# Altium project R01L_F.PrjPCB (part 1 of 3)
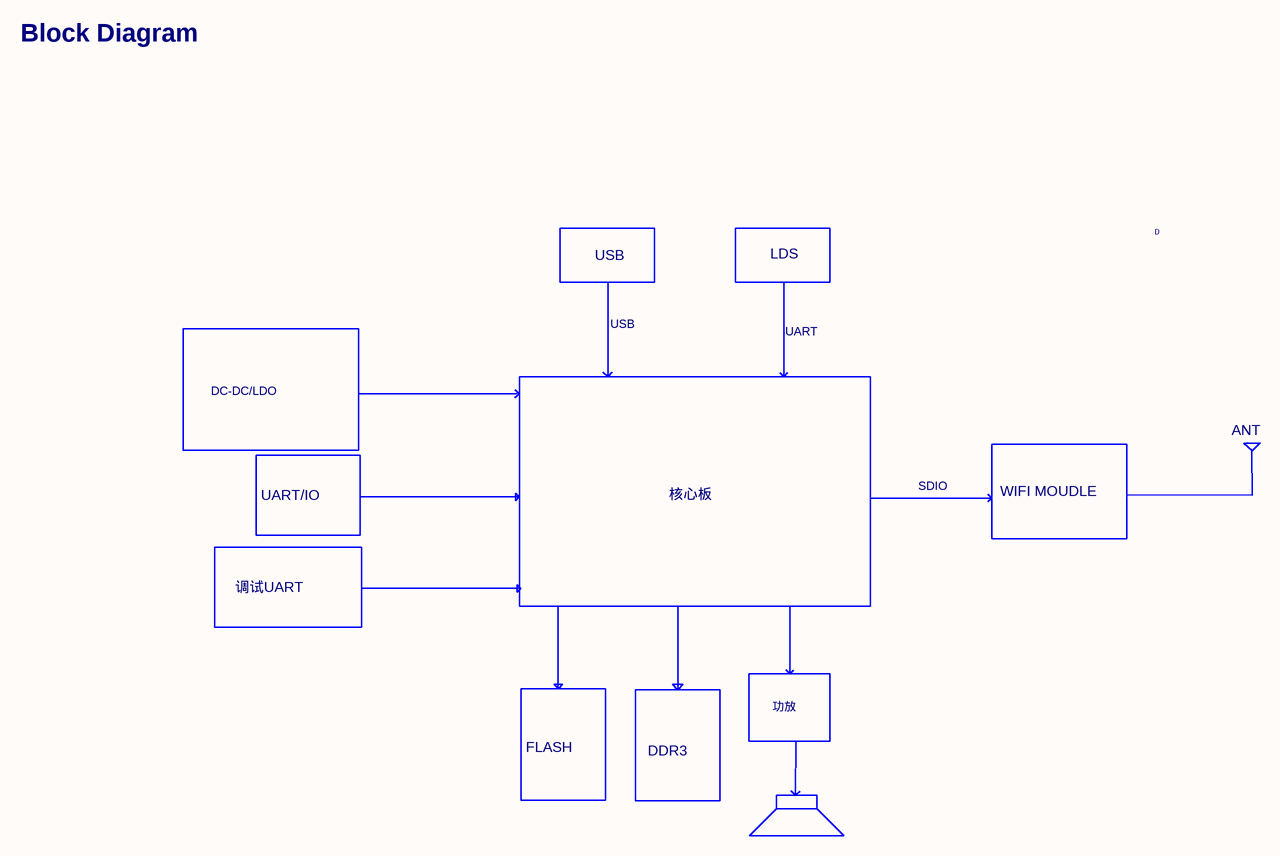
[diagram p0: 01_BLOCK_DIAGRAM.SchDoc]
kangjin: Kang jin; Organization: 阿米诺技术; Title: R01L_F
22 sheets, 404 parts. Net scope: flat (ports and power ports of the same name join across sheets).
Board file: R01_F_V10.PcbDoc
Sheets:
  01_BLOCK_DIAGRAM.SchDoc
  02_POWERDIAGRAM-WITHOUT_BATTERY.SchDoc
  03a_POWER-DISCRETE.SchDoc
  04_POWER.SchDoc
  05_OSC_PLL.SchDoc
  06_DDR_CONTROLLER.SchDoc
  07_FLASH_CONTROLLER.SchDoc
  08_USB_CONTROLLER.SchDoc
  09_SARADC_OTP.SchDoc
  10_LCDC_MAC_I2S1_JTAG.SchDoc
  11_SDIO_SDMMC.SchDoc
  12_GPIO_I2S0_PDM_SPDIF.SchDoc
  13_ACODEC.SchDoc
  14_RAM-DDR3_1X16BIT.SchDoc
  15_FLASH-NAND_FLASH.SchDoc
  18_AUDIO_PowerAmp-AnalogT.SchDoc
  25_USB_OTG.SchDoc
  52_MIPI_Panel.SchDoc
  60_WIFI_RTL8723DS.SchDoc
  80_TY_Zigbee.SchDoc
  93.SchDoc
  26_RS485.SchDoc

## Sheet 01_BLOCK_DIAGRAM.SchDoc: R01L_F
size A3; Organization: 阿米诺技术; Address4: www.amenuo.com; DocumentNumber: Kang jin; Revision: 1.0; SheetNumber: 1; SheetTotal: 23; Rule: 1.0

### Notes on the sheet
- Block Diagram
- D
- USB
- LDS
- UART
- DC-DC/LDO
- ANT
- UART/IO
- 核心板
- SDIO
- WIFI MOUDLE
- 调试UART
- 功放
- FLASH
- DDR3
- Title
- Size:
- Date:
- A3
- Engineer:
- Time:
- Revision:
- Sheet
- of
- File:

## Sheet 02_POWERDIAGRAM-WITHOUT_BATTERY.SchDoc: P30L
size A1; Author: Kang jin; Engineer: Kang jin; Organization: 六零加智能科技; Address4: www.nidone.com.cn; Revision: 1.0; SheetNumber: 2; SheetTotal: 23
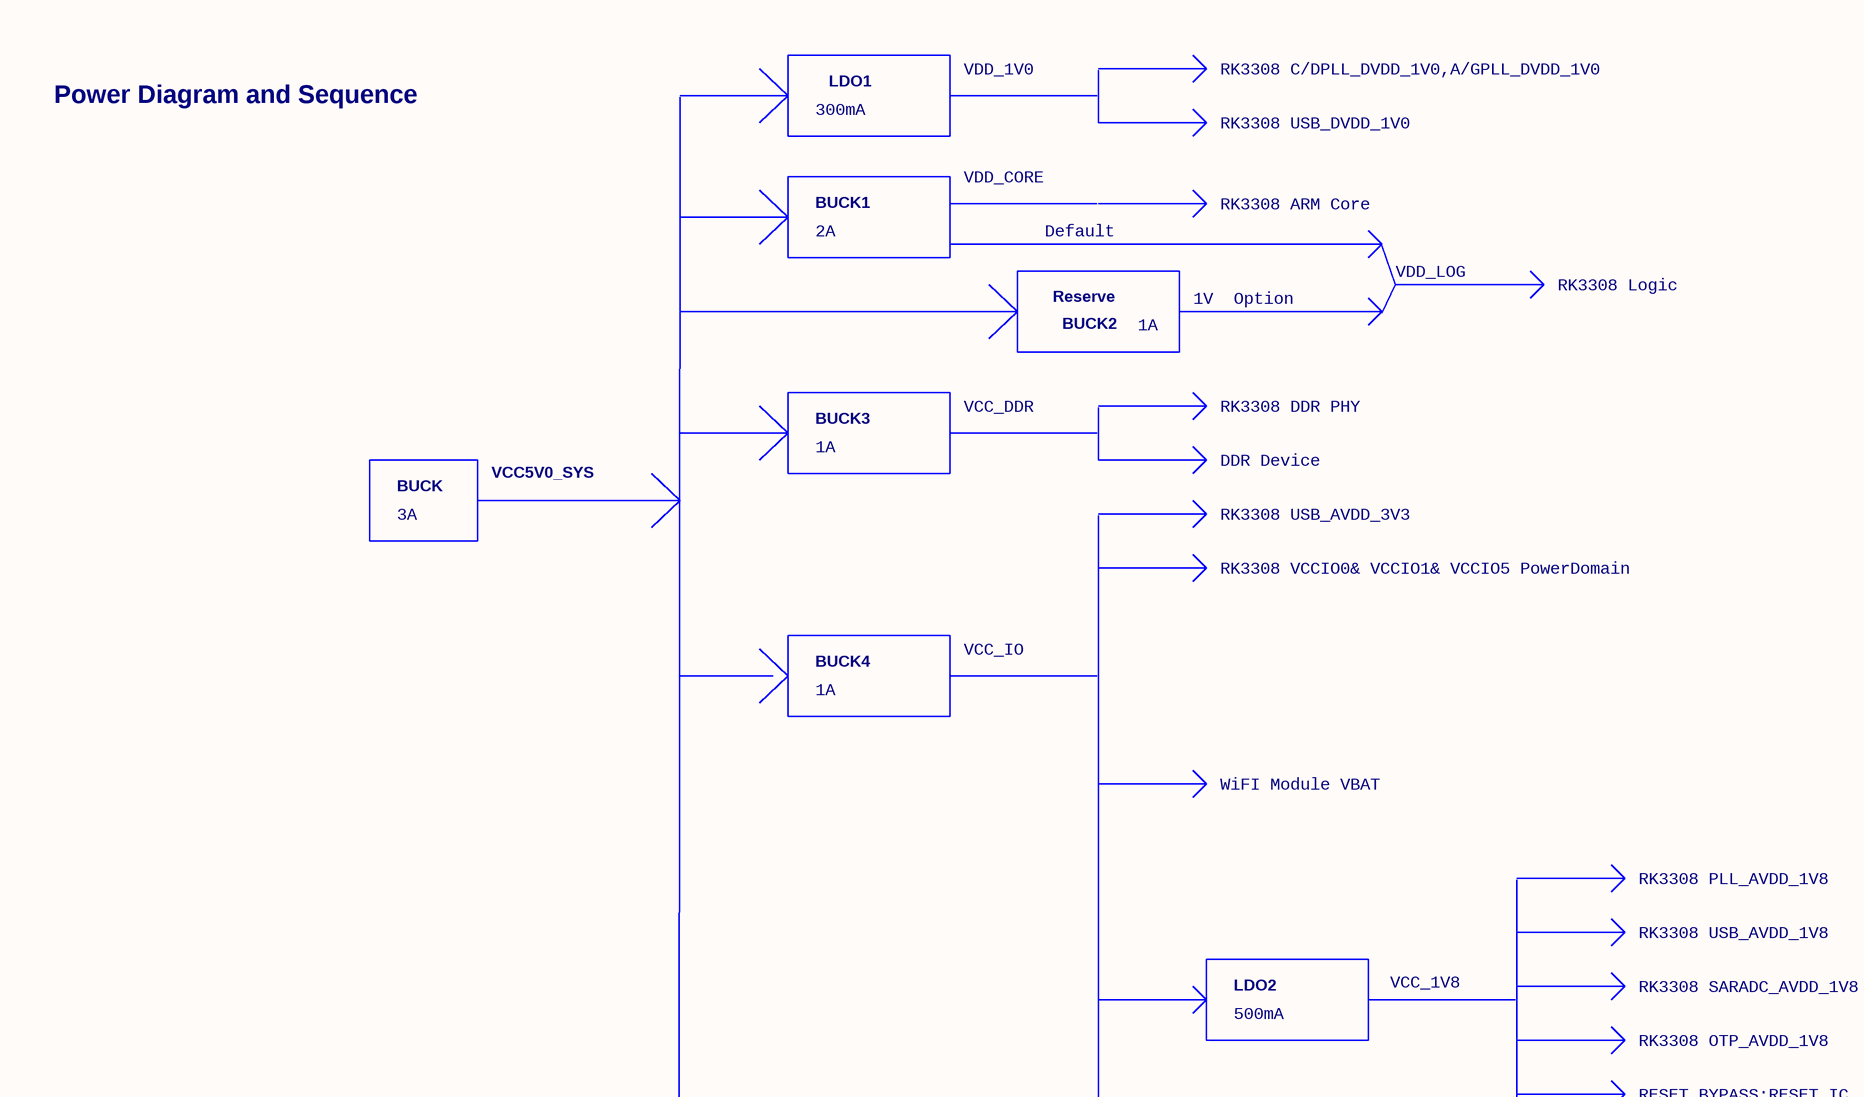
[diagram p1: 02_POWERDIAGRAM-WITHOUT_BATTERY.SchDoc, top left]
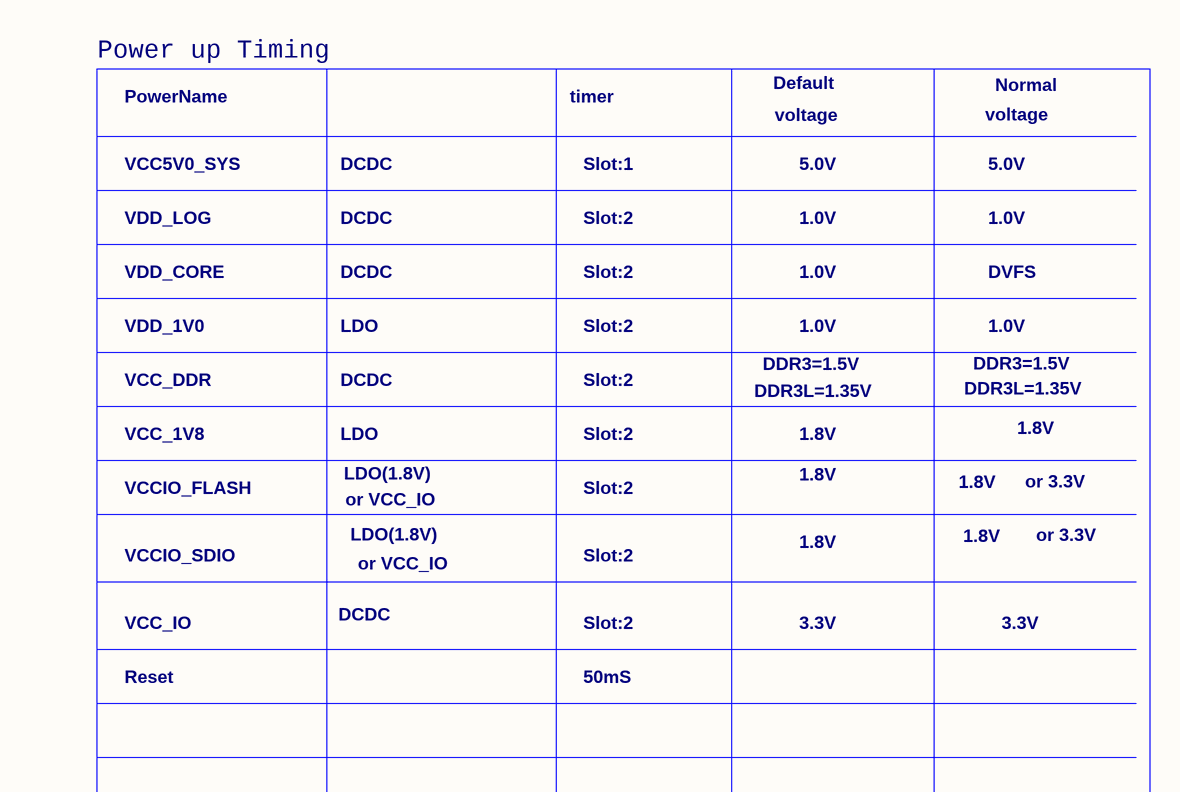
[diagram p2: 02_POWERDIAGRAM-WITHOUT_BATTERY.SchDoc, top right]
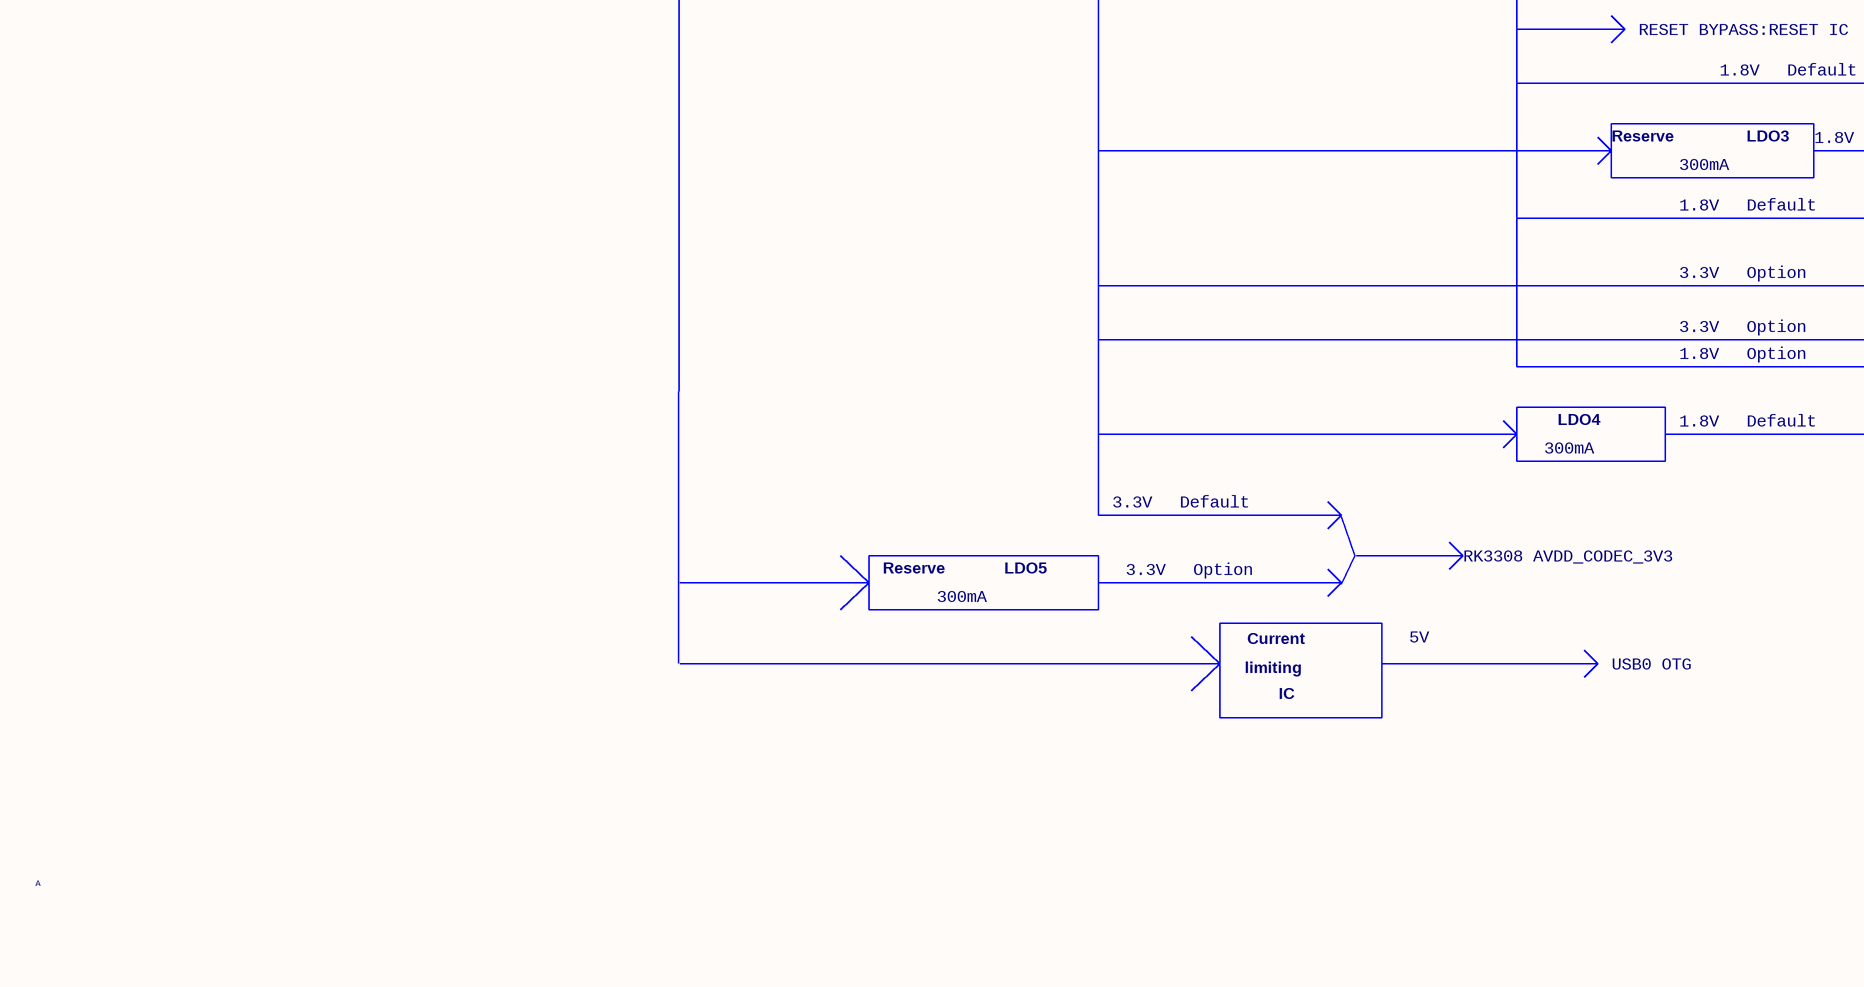
[diagram p3: 02_POWERDIAGRAM-WITHOUT_BATTERY.SchDoc, bottom left]
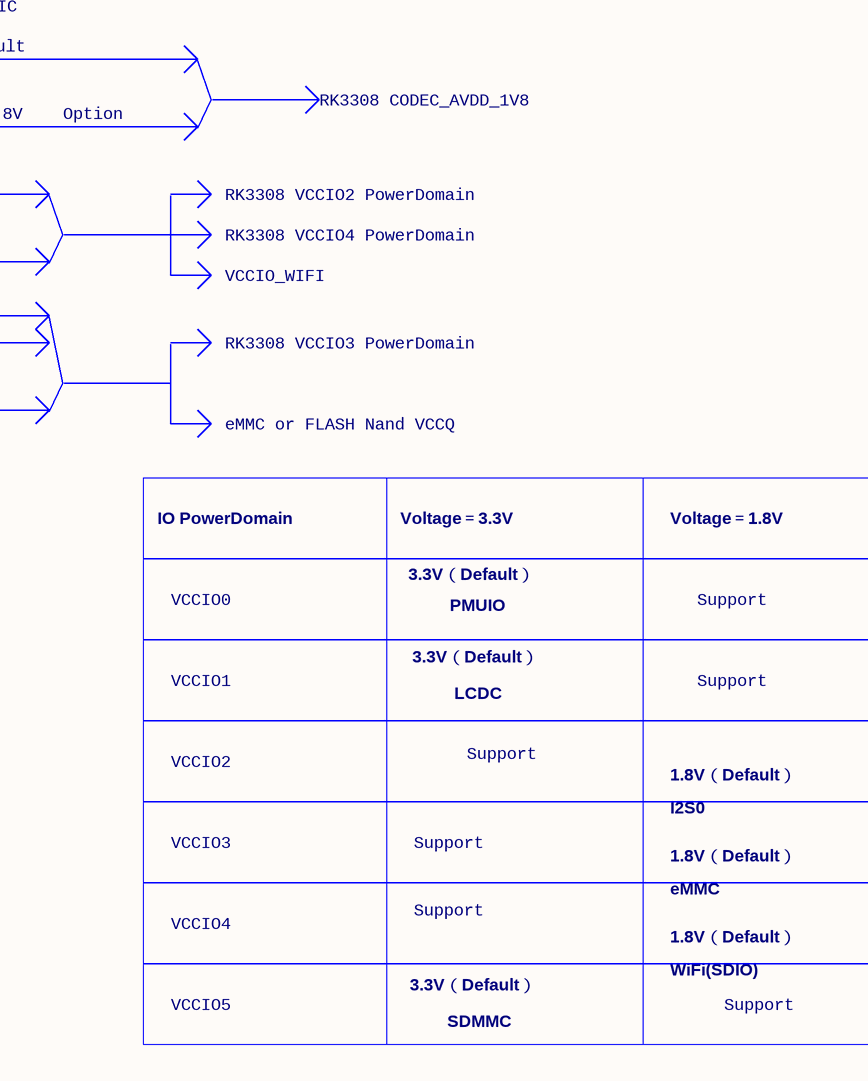
[diagram p4: 02_POWERDIAGRAM-WITHOUT_BATTERY.SchDoc, bottom right]

### Notes on the sheet
- Power Diagram and Sequence
- 300mA
- LDO1
- VDD_1V0
- RK3308 C/DPLL_DVDD_1V0,A/GPLL_DVDD_1V0
- Power up Timing
- PowerName
- timer
- Default
- voltage
- Normal
- VDD_CORE
- RK3308 USB_DVDD_1V0
- VCC5V0_SYS
- DCDC
- Slot:1
- 5.0V
- 2A
- BUCK1
- RK3308 ARM Core
- VDD_LOG
- Slot:2
- 1.0V
- Reserve
- 1V
- Option
- RK3308 Logic
- DVFS
- BUCK2
- 1A
- VCC_DDR
- LDO
- DDR3=1.5V
- DDR3L=1.35V
- BUCK3
- RK3308 DDR PHY
- VCC_1V8
- 1.8V
- 3A
- BUCK
- DDR Device
- RK3308 USB_AVDD_3V3
- VCCIO_FLASH
- LDO(1.8V)
- or VCC_IO
- or 3.3V
- RK3308 VCCIO0& VCCIO1& VCCIO5 PowerDomain
- VCCIO_SDIO
- VCC_IO
- 3.3V
- BUCK4
- Reset
- 50mS
- WiFI Module VBAT
- RK3308 PLL_AVDD_1V8
- LDO2
- RK3308 SARADC_AVDD_1V8
- RK3308 USB_AVDD_1V8
- 500mA
- RK3308 OTP_AVDD_1V8
- RESET BYPASS:RESET IC
- RK3308 CODEC_AVDD_1V8
- LDO3
- RK3308 VCCIO2 PowerDomain
- RK3308 VCCIO4 PowerDomain
- VCCIO_WIFI
- RK3308 VCCIO3 PowerDomain
- LDO4
- eMMC or FLASH Nand VCCQ
- LDO5
- RK3308 AVDD_CODEC_3V3
- IO PowerDomain
- Voltage＝3.3V
- 3.3V（Default）
- Voltage＝1.8V
- limiting
- Current
- 5V
- USB0 OTG
- VCCIO0
- PMUIO
- Support
- IC
- VCCIO1
- LCDC
- VCCIO2
- 1.8V（Default）
- A
- VCCIO3
- I2S0
- eMMC
- VCCIO4
- WiFi(SDIO)
- VCCIO5
- SDMMC
- Title:
- Size:
- Date:
- File:
- A1
- Engineer:
- Time:
- Revision:
- Sheet
- of

## Sheet 03a_POWER-DISCRETE.SchDoc: R01L_F
size A2
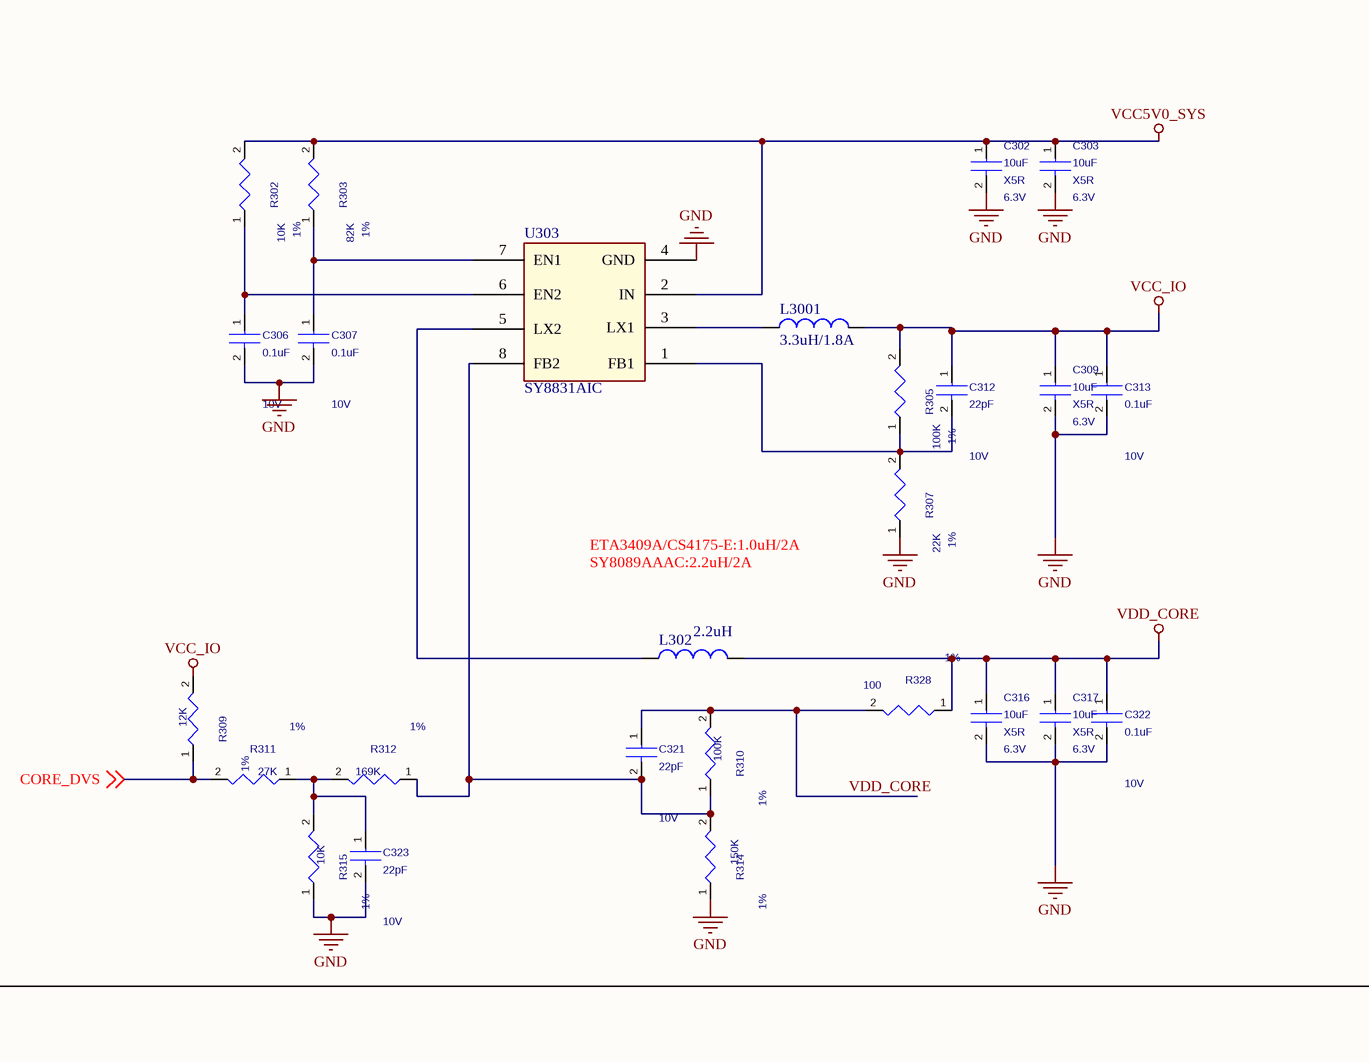
[diagram p5: 03a_POWER-DISCRETE.SchDoc, top left]
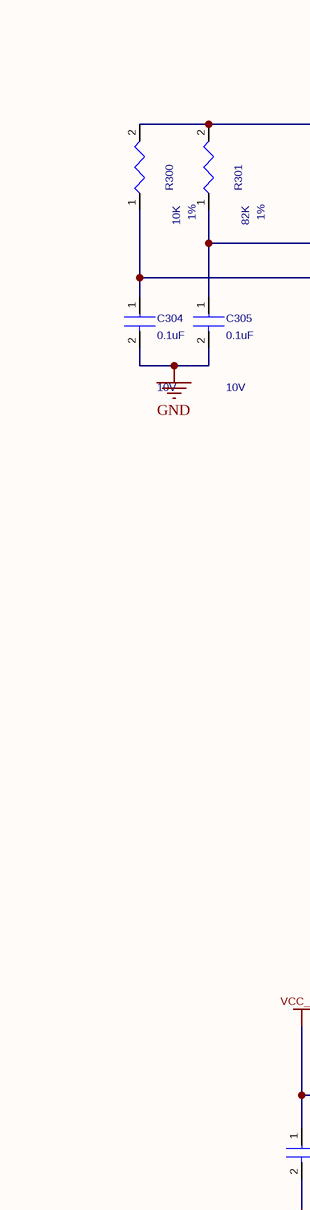
[diagram p6: 03a_POWER-DISCRETE.SchDoc, top middle]
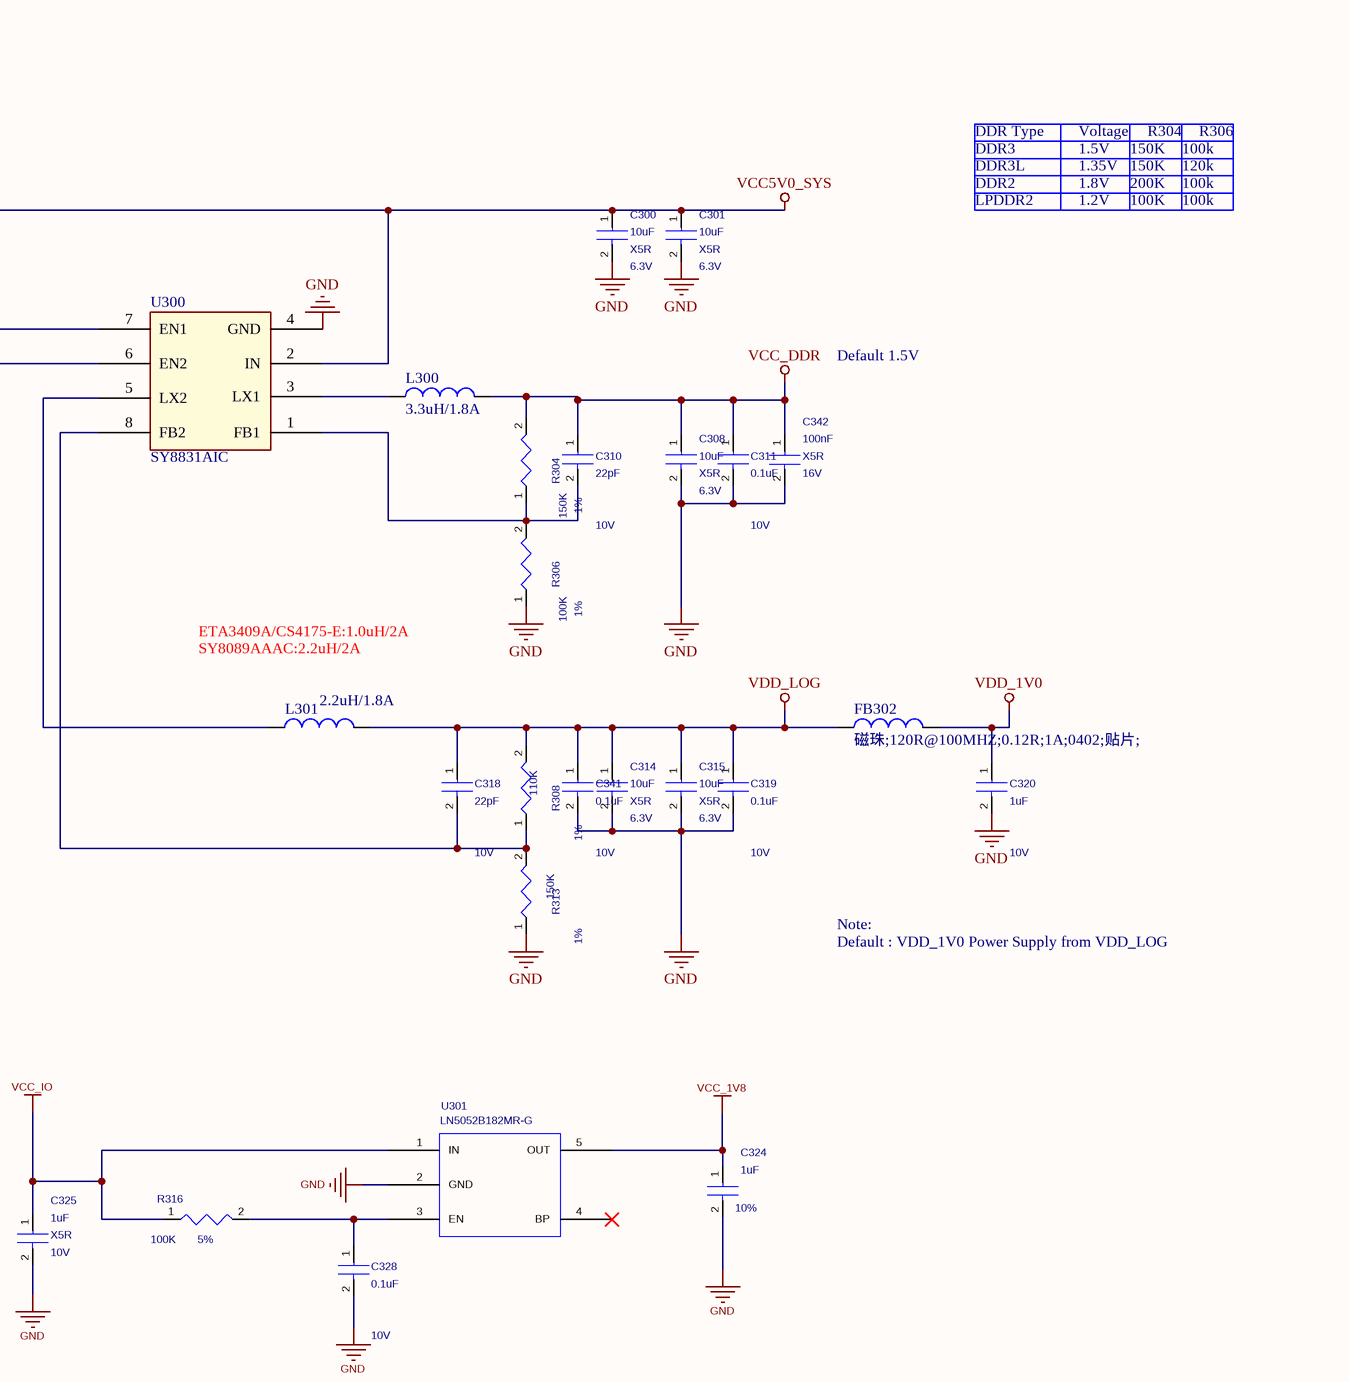
[diagram p7: 03a_POWER-DISCRETE.SchDoc, top right]
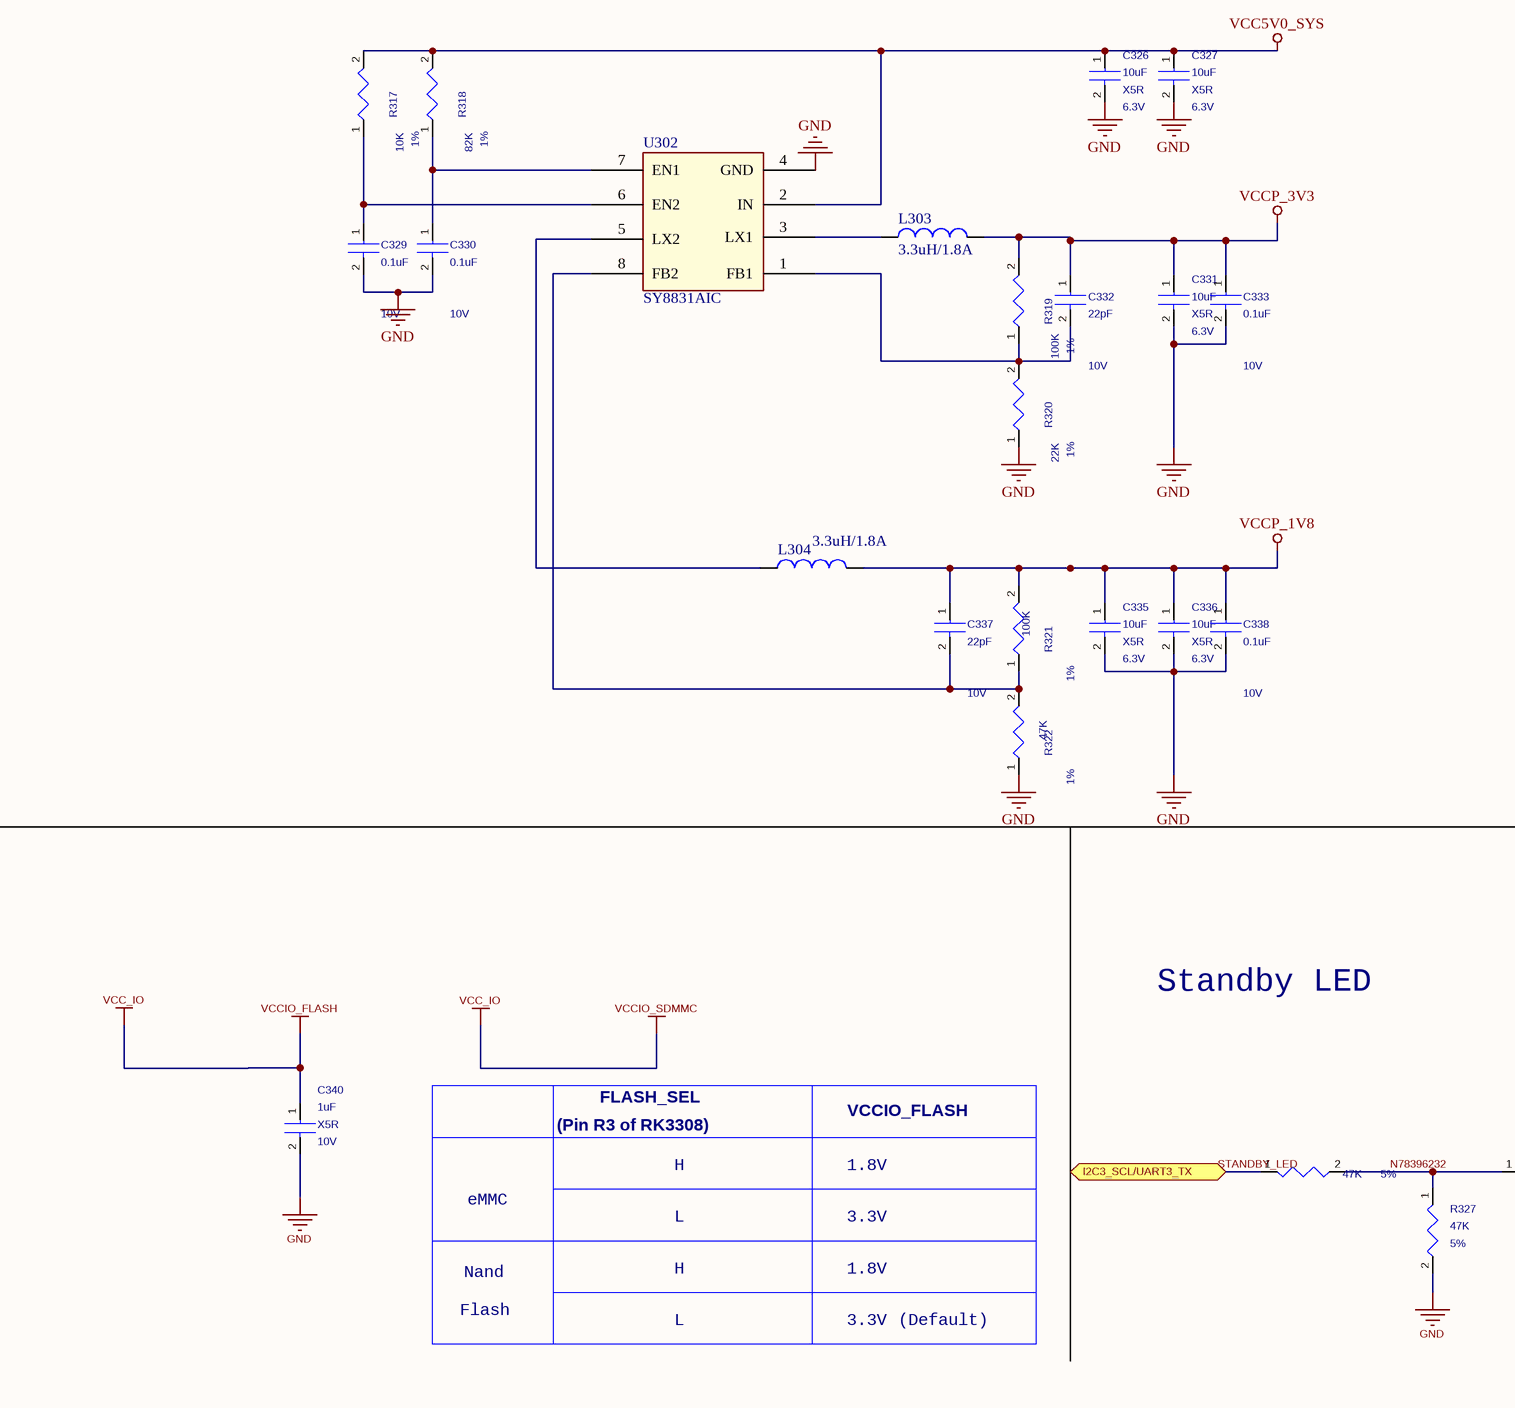
[diagram p8: 03a_POWER-DISCRETE.SchDoc, bottom left]
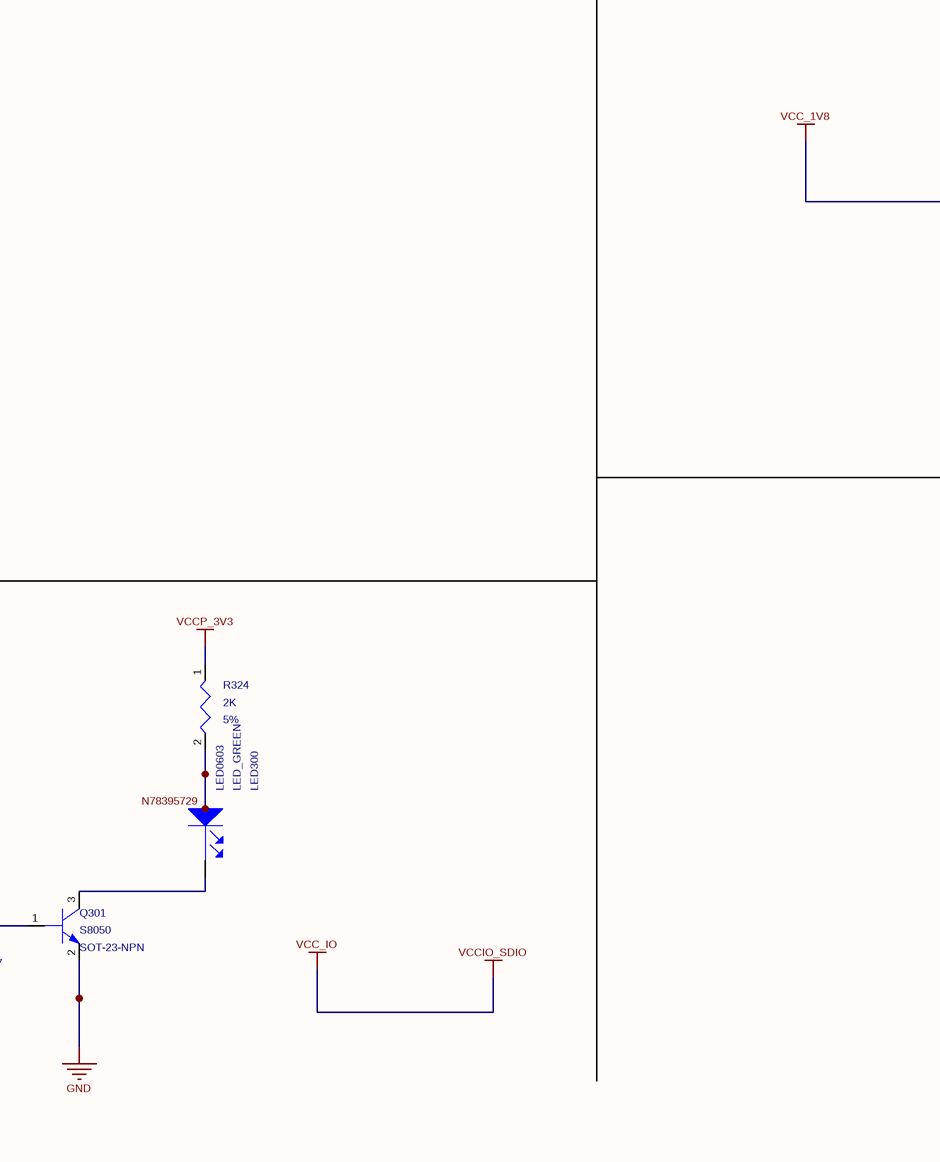
[diagram p9: 03a_POWER-DISCRETE.SchDoc, bottom middle]
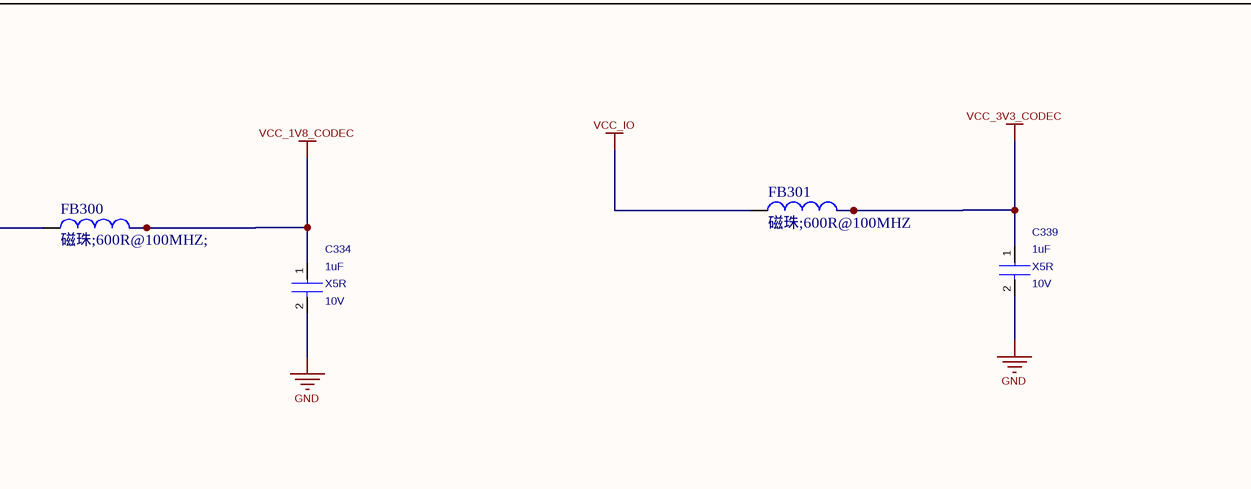
[diagram p10: 03a_POWER-DISCRETE.SchDoc, bottom right]

### Parts
C300  value 10uF  Dielectric: X5R  Voltage: 6.3V  [C0603]  (hidden comment: CAP_NP_2)
C301  value 10uF  Dielectric: X5R  Voltage: 6.3V  [C0603]  (hidden comment: CAP_NP_2)
C302  value 10uF  Dielectric: X5R  Voltage: 6.3V  [C0603]  (hidden comment: CAP_NP_2)
C303  value 10uF  Dielectric: X5R  Voltage: 6.3V  [C0603]  (hidden comment: CAP_NP_2)
C304  value 0.1uF  Voltage: 10V  [C0402]  (hidden comment: CAP_NP_2)
C305  value 0.1uF  Voltage: 10V  [C0402]  (hidden comment: CAP_NP_2)
C306  value 0.1uF  Voltage: 10V  [C0402]  (hidden comment: CAP_NP_2)
C307  value 0.1uF  Voltage: 10V  [C0402]  (hidden comment: CAP_NP_2)
C308  value 10uF  Dielectric: X5R  Voltage: 6.3V  [C0603]  (hidden comment: CAP_NP_2)
C309  value 10uF  Dielectric: X5R  Voltage: 6.3V  [C0603]  (hidden comment: CAP_NP_2)
C310  value 22pF  Voltage: 10V  [C0402]  (hidden comment: CAP_NP_2)
C311  value 0.1uF  Voltage: 10V  [C0402]  (hidden comment: CAP_NP_2)
C312  value 22pF  Voltage: 10V  [C0402]  (hidden comment: CAP_NP_2)
C313  value 0.1uF  Voltage: 10V  [C0402]  (hidden comment: CAP_NP_2)
C314  value 10uF  Dielectric: X5R  Voltage: 6.3V  [C0603]  (hidden comment: CAP_NP_2)
C315  value 10uF  Dielectric: X5R  Voltage: 6.3V  [C0603]  (hidden comment: CAP_NP_2)
C316  value 10uF  Dielectric: X5R  Voltage: 6.3V  [C0603]  (hidden comment: CAP_NP_2)
C317  value 10uF  Dielectric: X5R  Voltage: 6.3V  [C0603]  (hidden comment: CAP_NP_2)
C318  value 22pF  Voltage: 10V  [C0402]  (hidden comment: CAP_NP_2)
C319  value 0.1uF  Voltage: 10V  [C0402]  (hidden comment: CAP_NP_2)
C320  value 1uF  Voltage: 10V  [C0402]  (hidden comment: CAP_NP_2)
C321  value 22pF  Voltage: 10V  [C0402]  (hidden comment: CAP_NP_2)
C322  value 0.1uF  Voltage: 10V  [C0402]  (hidden comment: CAP_NP_2)
C323  value 22pF  Voltage: 10V  [C0402]  (hidden comment: CAP_NP_2)
C324  value 1uF  Tolerance: 10%  [C0402]  (hidden comment: CAP_NP_2)
C325  value 1uF  Voltage: 10V  Dielectric: X5R  [C0402]  (hidden comment: CAP_NP_2)
C326  value 10uF  Dielectric: X5R  Voltage: 6.3V  [C0603]  (hidden comment: CAP_NP_2)
C327  value 10uF  Dielectric: X5R  Voltage: 6.3V  [C0603]  (hidden comment: CAP_NP_2)
C328  value 0.1uF  Voltage: 10V  [C0402]  (hidden comment: CAP_NP_2)
C329  value 0.1uF  Voltage: 10V  [C0402]  (hidden comment: CAP_NP_2)
C330  value 0.1uF  Voltage: 10V  [C0402]  (hidden comment: CAP_NP_2)
C331  value 10uF  Dielectric: X5R  Voltage: 6.3V  [C0603]  (hidden comment: CAP_NP_2)
C332  value 22pF  Voltage: 10V  [C0402]  (hidden comment: CAP_NP_2)
C333  value 0.1uF  Voltage: 10V  [C0402]  (hidden comment: CAP_NP_2)
C334  value 1uF  Voltage: 10V  Dielectric: X5R  [C0402]  (hidden comment: CAP_NP_2)
C335  value 10uF  Dielectric: X5R  Voltage: 6.3V  [C0603]  (hidden comment: CAP_NP_2)
C336  value 10uF  Dielectric: X5R  Voltage: 6.3V  [C0603]  (hidden comment: CAP_NP_2)
C337  value 22pF  Voltage: 10V  [C0402]  (hidden comment: CAP_NP_2)
C338  value 0.1uF  Voltage: 10V  [C0402]  (hidden comment: CAP_NP_2)
C339  value 1uF  Voltage: 10V  Dielectric: X5R  [C0402]  (hidden comment: CAP_NP_2)
C340  value 1uF  Voltage: 10V  Dielectric: X5R  [C0402]  (hidden comment: CAP_NP_2)
C341  value 0.1uF  Voltage: 10V  [C0402]  (hidden comment: CAP_NP_2)
C342  value 100nF  Voltage: 16V  Dielectric: X5R  [C0402]  (hidden comment: CAP_NP_2)
FB300  磁珠;600R@100MHZ;  [L0402]
FB301  磁珠;600R@100MHZ  [L0402]
FB302  磁珠;120R@100MHZ;0.12R;1A;0402;贴片;  [L0402]
L300  3.3uH/1.8A  [IND2520]
L301  2.2uH/1.8A  [IND2520]
L302  2.2uH  [IND2520]
L303  3.3uH/1.8A  [IND2520]
L304  3.3uH/1.8A  [IND2520]
L3001  3.3uH/1.8A  [IND2520]
LED300  value LED_GREEN  [LED0603]  (hidden comment: LED)
Q301  value S8050  PCB DECAL: SOT-23-NPN  [SOT23]  (hidden comment: NPN)
R300  value 10K  Tolerance: 1%  [R0402]  (hidden comment: RESISTOR)
R301  value 82K  Tolerance: 1%  [R0402]  (hidden comment: RESISTOR)
R302  value 10K  Tolerance: 1%  [R0402]  (hidden comment: RESISTOR)
R303  value 82K  Tolerance: 1%  [R0402]  (hidden comment: RESISTOR)
R304  value 150K  Tolerance: 1%  [R0402]  (hidden comment: RESISTOR)
R305  value 100K  Tolerance: 1%  [R0402]  (hidden comment: RESISTOR)
R306  value 100K  Tolerance: 1%  [R0402]  (hidden comment: RESISTOR)
R307  value 22K  Tolerance: 1%  [R0402]  (hidden comment: RESISTOR)
R308  value 110K  Tolerance: 1%  [R0402]  (hidden comment: RESISTOR)
R309  value 12K  Tolerance: 1%  [R0402]  (hidden comment: RESISTOR)
R310  value 100K  Tolerance: 1%  [R0402]  (hidden comment: RESISTOR)
R311  value 27K  Tolerance: 1%  [R0402]  (hidden comment: RESISTOR)
R312  value 169K  Tolerance: 1%  [R0402]  (hidden comment: RESISTOR)
R313  value 150K  Tolerance: 1%  [R0402]  (hidden comment: RESISTOR)
R314  value 150K  Tolerance: 1%  [R0402]  (hidden comment: RESISTOR)
R315  value 10K  Tolerance: 1%  [R0402]  (hidden comment: RESISTOR)
R316  value 100K  Tolerance: 5%  [R0402]  (hidden comment: RESISTOR)
R317  value 10K  Tolerance: 1%  [R0402]  (hidden comment: RESISTOR)
R318  value 82K  Tolerance: 1%  [R0402]  (hidden comment: RESISTOR)
R319  value 100K  Tolerance: 1%  [R0402]  (hidden comment: RESISTOR)
R320  value 22K  Tolerance: 1%  [R0402]  (hidden comment: RESISTOR)
R321  value 100K  Tolerance: 1%  [R0402]  (hidden comment: RESISTOR)
R322  value 47K  Tolerance: 1%  [R0402]  (hidden comment: RESISTOR)
R324  value 2K  Tolerance: 5%  [R0402]  (hidden comment: RESISTOR)
R326  value 47K  Tolerance: 5%  [R0402]  (hidden comment: RESISTOR)
R327  value 47K  Tolerance: 5%  [R0402]  (hidden comment: RESISTOR)
R328  value 100  Tolerance: 1%  [R0402]  (hidden comment: RESISTOR)
U300  SY8831AIC  [TSOT23-8]
U301  LN5052B182MR-G  [SOT_23_5]
U302  SY8831AIC  [TSOT23-8]
U303  SY8831AIC  [TSOT23-8]

### Ports
I2C3_SCL/UART3_TX (bidir)

### Nets
GND: C300.2 C301.2 C302.2 C303.2 C304.2 C305.2 C306.2 C307.2 C308.2 C309.2 C311.2 C313.2 C314.2 C315.2 C316.2 C317.2 C319.2 C320.2 C322.2 C323.2 C324.2 C325.2 C326.2 C327.2 C328.2 C329.2 C330.2 C331.2 C333.2 C334.2 C335.2 C336.2 C338.2 C339.2 C340.2 C341.2 C342.2 Q301.2(EMITTER) R306.1 R307.1 R313.1 R314.1 R315.1 R320.1 R322.1 R327.2 U300.4(GND) U301.2(GND) U302.4(GND) U303.4(GND)
VCC5V0_SYS: C300.1 C301.1 C302.1 C303.1 C326.1 C327.1 R300.2 R301.2 R302.2 R303.2 R317.2 R318.2 U300.2(IN) U302.2(IN) U303.2(IN)
VCC_1V8: C324.1 FB300.1 U301.5(OUT)
VCC_1V8_CODEC: C334.1 FB300.2
VCC_3V3_CODEC: C339.1 FB301.2
VCC_DDR: C308.1 C310.1 C311.1 C342.1 L300.2 R304.2
VCC_IO: C309.1 C312.1 C313.1 C325.1 C340.1 FB301.1 L3001.2 R305.2 R309.2 R316.1 U301.1(IN)  [also labelled VCCIO_FLASH, VCCIO_SDIO, VCCIO_SDMMC]
VCCP_1V8: C335.1 C336.1 C337.1 C338.1 L304.2 R321.2
VCCP_3V3: C331.1 C332.1 C333.1 L303.2 R319.2 R324.1
VDD_1V0: C320.1 FB302.2
VDD_CORE: C316.1 C317.1 C321.1 C322.1 L302.2 R310.2 R328.1 R328.2
VDD_LOG: C314.1 C315.1 C318.1 C319.1 C341.1 FB302.1 L301.2 R308.2
CORE_DVS: R309.1 R311.2 ; off-sheet CORE_DVS
I2C3_SCL/UART3_TX: R326.1 ; port I2C3_SCL/UART3_TX
N78396232: Q301.1(BASE) R326.2 R327.1
NetC304_1: C304.1 R300.1 U300.6(EN2)
NetC305_1: C305.1 R301.1 U300.7(EN1)
NetC306_1: C306.1 R302.1 U303.6(EN2)
NetC307_1: C307.1 R303.1 U303.7(EN1)
NetC310_2: C310.2 R304.1 R306.2 U300.1(FB1)
NetC312_2: C312.2 R305.1 R307.2 U303.1(FB1)
NetC318_2: C318.2 R308.1 R313.2 U300.8(FB2)
NetC321_2: C321.2 R310.1 R312.1 R314.2 U303.8(FB2)
NetC323_1: C323.1 R311.1 R312.2 R315.2
NetC328_1: C328.1 R316.2 U301.3(EN)
NetC329_1: C329.1 R317.1 U302.6(EN2)
NetC330_1: C330.1 R318.1 U302.7(EN1)
NetC332_2: C332.2 R319.1 R320.2 U302.1(FB1)
NetC337_2: C337.2 R321.1 R322.2 U302.8(FB2)
NetL300_1: L300.1 U300.3(LX1)
NetL301_1: L301.1 U300.5(LX2)
NetL302_1: L302.1 U303.5(LX2)
NetL303_1: L303.1 U302.3(LX1)
NetL304_1: L304.1 U302.5(LX2)
NetL3001_1: L3001.1 U303.3(LX1)
NetLED300_1: LED300.1(ANODE) R324.2
NetLED300_2: LED300.2(CATHODE) Q301.3(COLLECTOR)

Not connected (* = marked no-connect by the designer): U301 4(BP)*

### Notes on the sheet
- DDR Type
- DDR3
- DDR3L
- DDR2
- LPDDR2
- Voltage
- 1.5V
- 1.35V
- 1.8V
- 1.2V
- 150K
- 200K
- 100K
- R304
- 100k
- 120k
- R306
- Default 1.5V
- ETA3409A/CS4175-E:1.0uH/2A
- SY8089AAAC:2.2uH/2A
- Note:
- Default : VDD_1V0 Power Supply from VDD_LOG
- Standby LED
- FLASH_SEL
- (Pin R3 of RK3308)
- H
- VCCIO_FLASH
- Nand
- eMMC
- L
- 3.3V
- Flash
- (Default)
- Labels drawn without touching a wire or pin: N78395729, STANDBY_LED
- Title
- Size:
- Date:
- File:
- A2
- Number:
- Time:
- Revision:
- Sheet
- of

### Library data of the parts
C300-C303 C308 C309 C314-C317 C326 C327 C331 C335 C336 = CAP_NP_2: cap,10.00uF,+/-10%,6.3V,X5R,C0603; Manufacturer: TDK; RK_PN: C1608X5R0J106K080AB; Priority: A; Tolerance: 10%; Created_by: JJJ; Source_Path: Z:\RK_STANDARD_LIBRARY\CADENCE_CIS\RK_DISCRETE.OLB; Number: 1; PCB DECAL: C0603; Part_Type: C0603; Manufacturer_PN: C1608X5R0J106K080AB
C304-C307 C311 C313 C319 C322 C328-C330 C333 C338 C341 = CAP_NP_2: cap,0.1uF,+/-10%,10V,X5R,C0402; Manufacturer: TDK; RK_PN: C1005X5R1A105K050BB; Priority: A; C_Voltage: 6.3V; Tolerance: 10%; Created_by: JJJ; Source_Path: Z:\RK_STANDARD_LIBRARY\CADENCE_CIS\RK_DISCRETE.OLB; Part_Type: C0402; Dielectric: X5R; Manufacturer_PN: C1005X5R1A105K050BB; PCB DECAL: C0402
C310 C312 C318 C321 C323 C332 C337 = CAP_NP_2: cap,22pF,+/-10%,10V,X5R,C0402; Manufacturer: TDK; RK_PN: C1005X5R1A105K050BB; Priority: A; C_Voltage: 6.3V; Tolerance: 10%; Created_by: JJJ; Source_Path: Z:\RK_STANDARD_LIBRARY\CADENCE_CIS\RK_DISCRETE.OLB; Part_Type: C0402; Dielectric: X5R; Manufacturer_PN: C1005X5R1A105K050BB; PCB DECAL: C0402
C320 = CAP_NP_2: cap,1uF,+/-10%,10V,X5R,C0402; Manufacturer: TDK; RK_PN: C1005X5R1A105K050BB; Priority: A; C_Voltage: 6.3V; Tolerance: 10%; Created_by: JJJ; Source_Path: Z:\RK_STANDARD_LIBRARY\CADENCE_CIS\RK_DISCRETE.OLB; Part_Type: C0402; Dielectric: X5R; Manufacturer_PN: C1005X5R1A105K050BB; PCB DECAL: C0402
C324 = CAP_NP_2: cap,1.00uF,+/-10%,10V,X5R,C0402; Manufacturer_PN: C1005X5R1A105K050BB; Manufacturer: TDK; Created_by: JJJ; C_Voltage: 6.3V; Priority: A; Source_Path: Z:\RK_STANDARD_LIBRARY\CADENCE_CIS\RK_DISCRETE.OLB; PCB DECAL: C0402; Voltage: 10V; Dielectric: X5R; Part_Type: C0402; RK_PN: C1005X5R1A105K050BB
C325 = CAP_NP_2: cap,1.00uF,+/-10%,10V,X5R,C0402; Manufacturer: TDK; RK_PN: C1005X5R1A105K050BB; Priority: A; C_Voltage: 6.3V; Tolerance: 10%; Created_by: JJJ; Source_Path: Z:\RK_STANDARD_LIBRARY\CADENCE_CIS\RK_DISCRETE.OLB; PCB DECAL: C0402; Part_Type: C0402; Manufacturer_PN: C1005X5R1A105K050BB
C334 C339 C340 = CAP_NP_2: cap,1.00uF,+/-10%,10V,X5R,C0402; Manufacturer_PN: C1005X5R1A105K050BB; Manufacturer: TDK; Created_by: JJJ; Tolerance: 10%; C_Voltage: 6.3V; Priority: A; Source_Path: Z:\RK_STANDARD_LIBRARY\CADENCE_CIS\RK_DISCRETE.OLB; PCB DECAL: C0402; Part_Type: C0402; RK_PN: C1005X5R1A105K050BB
C342 = CAP_NP_2: cap,100.00nF,+/-10%,16V,X5R,C0402; Manufacturer: TDK; Number: 1; RK_PN: C1005X5R1C104K050BA; Priority: A; Tolerance: 10%; Created_by: JJJ; Source_Path: Z:\RK_STANDARD_LIBRARY\CADENCE_CIS\RK_DISCRETE.OLB; PCB DECAL: C0402; Part_Type: C0402; Manufacturer_PN: C1005X5R1C104K050BA
FB300 = INDUCTOR: GZ0603D601TF
FB301 = INDUCTOR: L0603-0欧姆-1A
FB302 = INDUCTOR: PZ1005U121-1R0T
L300 L303 L304 L3001 = INDUCTOR: SWPA252012S3R3MT
L301 L302 = INDUCTOR: SPH252012H2R2MT
LED300 = LED: 贴片LED灯，0603，绿色; Created_by: JJJ; Priority: A; Source_Path: Z:\RK_STANDARD_LIBRARY\CADENCE_CIS\RK_DISCRETE.OLB; PCB DECAL: LED0603; Part_Type: LED; RK_PN: LED_GREEN
Q301 = NPN: S8050,SOT23; Manufacturer_PN: S8050_SOT23; Manufacturer: 长电; Created_by: JJJ; Pc: 0.3W; Vceo: 25V; Ic: 0.5A; Priority: A; Source_Path: Z:\RK_STANDARD_LIBRARY\CADENCE_CIS\RK_DISCRETE.OLB; Number: 1; Geometry.Height: 1.100mm; Part_Type: NPN; RK_PN: S8050
R300 R302 R315 R317 = RESISTOR: ?用厚膜电阻,10K,+/-1%,R0402,1/16W.; Manufacturer_PN: RC0402FR-0727KL; Manufacturer: YAGEO; Created_by: YTL; Wattage: 1/16W; Priority: A; Source_Path: Z:\RK_STANDARD_LIBRARY\CADENCE_CIS\RK_DISCRETE.OLB; PCB DECAL: R0402; Part_Type: ?用厚膜电阻; RK_PN: RC0402FR-0727KL
R301 R303 R318 = RESISTOR: ?用厚膜电阻,82K,+/-1%,R0402,1/16W.; Manufacturer_PN: RC0402FR-0727KL; Manufacturer: YAGEO; Created_by: YTL; Wattage: 1/16W; Priority: A; Source_Path: Z:\RK_STANDARD_LIBRARY\CADENCE_CIS\RK_DISCRETE.OLB; PCB DECAL: R0402; Part_Type: ?用厚膜电阻; RK_PN: RC0402FR-0727KL
R304 R313 R314 = RESISTOR: ?用厚膜电阻,150K,+/-1%,R0402,1/16W.; Manufacturer_PN: RC0402FR-0727KL; Manufacturer: YAGEO; Created_by: YTL; Wattage: 1/16W; Priority: A; Source_Path: Z:\RK_STANDARD_LIBRARY\CADENCE_CIS\RK_DISCRETE.OLB; PCB DECAL: R0402; Part_Type: ?用厚膜电阻; RK_PN: RC0402FR-0727KL
R305 R306 R310 R319 R321 = RESISTOR: ?用厚膜电阻,100K,+/-1%,R0402,1/16W.; Manufacturer_PN: RC0402FR-0727KL; Manufacturer: YAGEO; Created_by: YTL; Wattage: 1/16W; Priority: A; Source_Path: Z:\RK_STANDARD_LIBRARY\CADENCE_CIS\RK_DISCRETE.OLB; PCB DECAL: R0402; Part_Type: ?用厚膜电阻; RK_PN: RC0402FR-0727KL
R307 R320 = RESISTOR: ?用厚膜电阻,22K,+/-1%,R0402,1/16W.; Manufacturer_PN: RC0402FR-0727KL; Manufacturer: YAGEO; Created_by: YTL; Wattage: 1/16W; Priority: A; Source_Path: Z:\RK_STANDARD_LIBRARY\CADENCE_CIS\RK_DISCRETE.OLB; PCB DECAL: R0402; Part_Type: ?用厚膜电阻; RK_PN: RC0402FR-0727KL
R308 = RESISTOR: ?用厚膜电阻,110K,+/-1%,R0402,1/16W.; Manufacturer_PN: RC0402FR-0727KL; Manufacturer: YAGEO; Created_by: YTL; Wattage: 1/16W; Priority: A; Source_Path: Z:\RK_STANDARD_LIBRARY\CADENCE_CIS\RK_DISCRETE.OLB; PCB DECAL: R0402; Part_Type: ?用厚膜电阻; RK_PN: RC0402FR-0727KL
R309 = RESISTOR: ?用厚膜电阻,12K,+/-1%,R0402,1/16W.; Manufacturer_PN: RC0402FR-0727KL; Manufacturer: YAGEO; Created_by: YTL; Wattage: 1/16W; Priority: A; Source_Path: Z:\RK_STANDARD_LIBRARY\CADENCE_CIS\RK_DISCRETE.OLB; PCB DECAL: R0402; Part_Type: ?用厚膜电阻; RK_PN: RC0402FR-0727KL
R311 = RESISTOR: ?用厚膜电阻,27K,+/-1%,R0402,1/16W.; Manufacturer_PN: RC0402FR-0727KL; Manufacturer: YAGEO; Created_by: YTL; Wattage: 1/16W; Priority: A; Source_Path: Z:\RK_STANDARD_LIBRARY\CADENCE_CIS\RK_DISCRETE.OLB; PCB DECAL: R0402; Part_Type: ?用厚膜电阻; RK_PN: RC0402FR-0727KL
R312 = RESISTOR: ?用厚膜电阻,169K,+/-1%,R0402,1/16W.; Manufacturer_PN: RC0402FR-0727KL; Manufacturer: YAGEO; Created_by: YTL; Wattage: 1/16W; Priority: A; Source_Path: Z:\RK_STANDARD_LIBRARY\CADENCE_CIS\RK_DISCRETE.OLB; PCB DECAL: R0402; Part_Type: ?用厚膜电阻; RK_PN: RC0402FR-0727KL
R316 = RESISTOR: ?用厚膜电阻,100K,+/-5%,R0402,1/16W.; Manufacturer: YAGEO; RK_PN: RC0402JR-07100KL; Priority: A; Wattage: 1/16W; Created_by: YTL; Source_Path: Z:\RK_STANDARD_LIBRARY\CADENCE_CIS\RK_DISCRETE.OLB; Number: 1; PCB DECAL: R0402; Part_Type: ?用厚膜电阻; Manufacturer_PN: RC0402JR-07100KL
R322 = RESISTOR: ?用厚膜电阻,47K,+/-1%,R0402,1/16W.; Manufacturer_PN: RC0402FR-0727KL; Manufacturer: YAGEO; Created_by: YTL; Wattage: 1/16W; Priority: A; Source_Path: Z:\RK_STANDARD_LIBRARY\CADENCE_CIS\RK_DISCRETE.OLB; PCB DECAL: R0402; Part_Type: ?用厚膜电阻; RK_PN: RC0402FR-0727KL
R324 = RESISTOR: ?用厚膜电阻,2K,+/-5%,R0402,1/16W.; Manufacturer: YAGEO; RK_PN: RC0402JR-072KL; Priority: A; Wattage: 1/16W; Created_by: YTL; Source_Path: Z:\RK_STANDARD_LIBRARY\CADENCE_CIS\RK_DISCRETE.OLB; PCB DECAL: R0402; Part_Type: ?用厚膜电阻; Manufacturer_PN: RC0402JR-072KL
R326 = RESISTOR: ?用厚膜电阻,47K,+/-5%,R0402,1/16W.; Manufacturer_PN: RC0402JR-0747KL; Manufacturer: YAGEO; Created_by: YTL; Wattage: 1/16W; Priority: A; Source_Path: Z:\RK_STANDARD_LIBRARY\CADENCE_CIS\RK_DISCRETE.OLB; PCB DECAL: R0402; Part_Type: ?用厚膜电阻; RK_PN: RC0402JR-0747KL
R327 = RESISTOR: ?用厚膜电阻,47K,+/-5%,R0402,1/16W.; Manufacturer: YAGEO; RK_PN: RC0402JR-0747KL; Priority: A; Wattage: 1/16W; Created_by: YTL; Source_Path: Z:\RK_STANDARD_LIBRARY\CADENCE_CIS\RK_DISCRETE.OLB; PCB DECAL: R0402; Part_Type: ?用厚膜电阻; Manufacturer_PN: RC0402JR-0747KL
R328 = RESISTOR: ?用厚膜电阻,100,+/-1%,R0402,1/16W.; Manufacturer_PN: RC0402FR-0727KL; Manufacturer: YAGEO; Created_by: YTL; Wattage: 1/16W; Priority: A; Source_Path: Z:\RK_STANDARD_LIBRARY\CADENCE_CIS\RK_DISCRETE.OLB; PCB DECAL: R0402; Part_Type: ?用厚膜电阻; RK_PN: RC0402FR-0727KL
U300 U302 U303 = SY8831: SY8831AICSOT23-8
U301 = LDO_PT5108: High-PSRR 600mA LDO.Output1.8V.; Part_Type: LDO; Manufacturer: Powtech(华润矽威）; RK_PN: ME6212C18M5G; Priority: A; Created_by: JJJ; Source_Path: Z:\RK_STANDARD_LIBRARY\CADENCE_CIS\RK_IC.OLB; Number: 1; PCB DECAL: SOT_23_5; Manufacturer_PN: LN5052B182MR-G; Value: LN5052B182MR-G

## Sheet 04_POWER.SchDoc: R01L_F
size A3; Organization: 六零加智能科技; Address4: www.nidone.com.cn; DocumentNumber: kan jin; Revision: 1.0; SheetNumber: 4; SheetTotal: 23
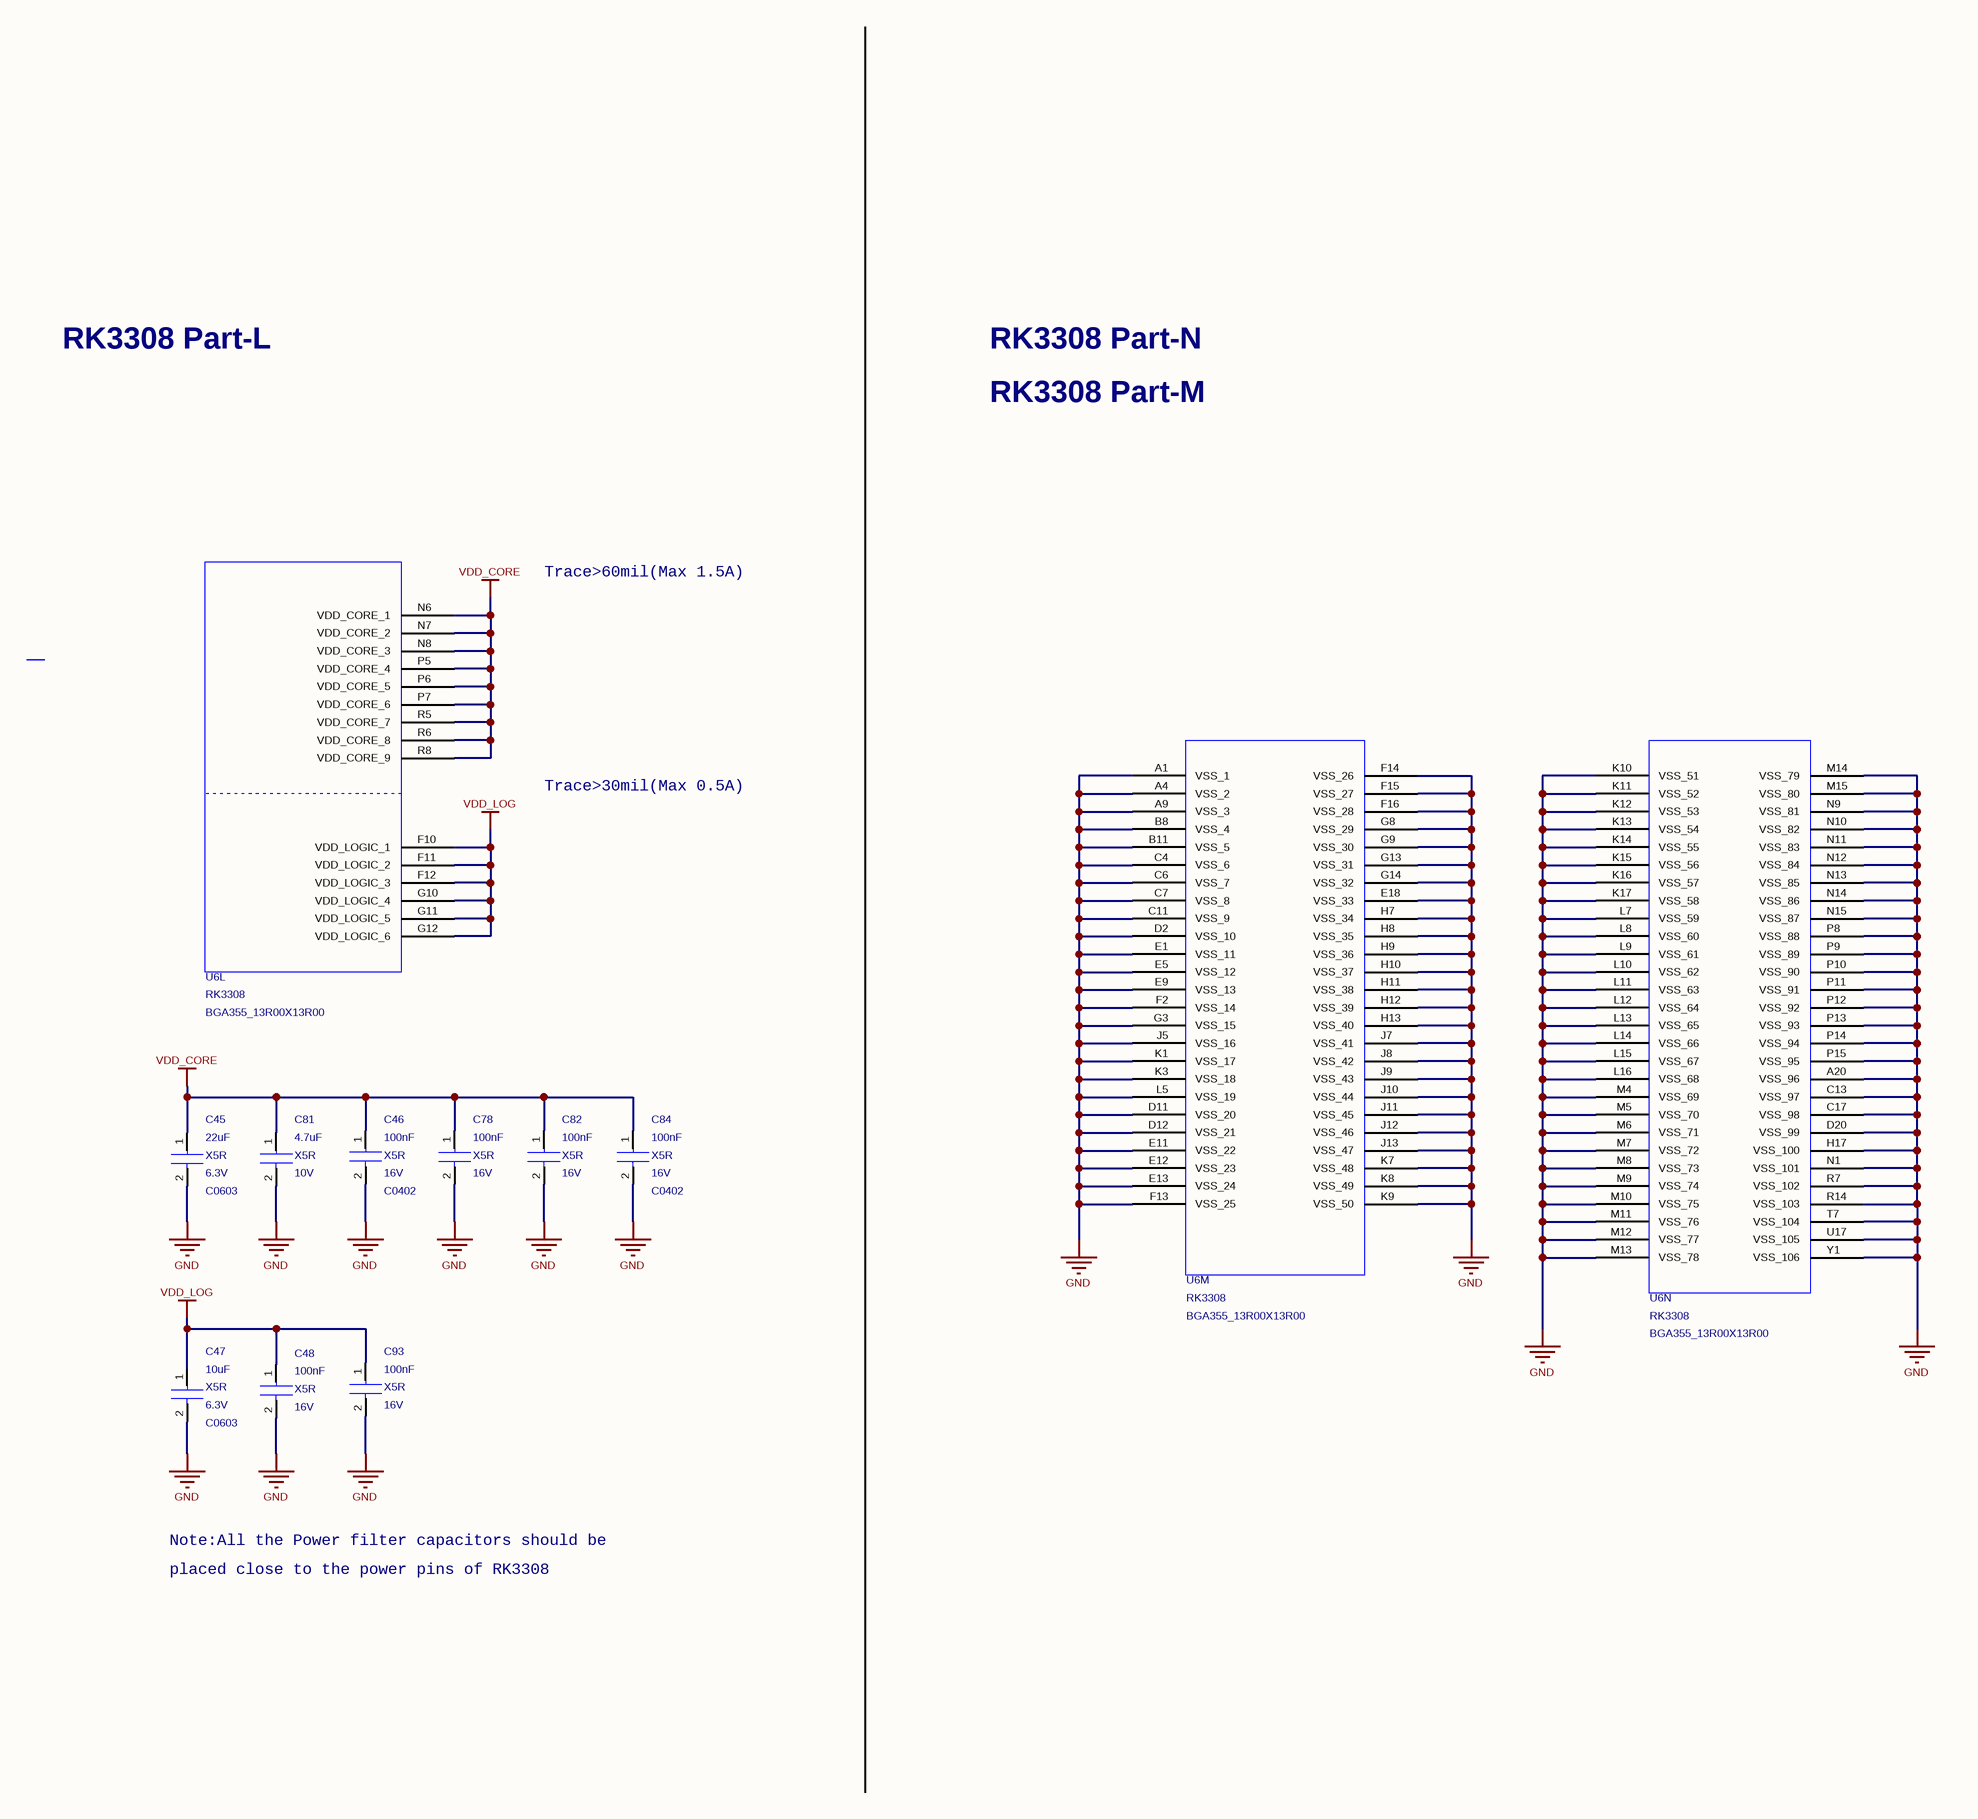
[diagram p11: 04_POWER.SchDoc]

### Parts
C45  value 22uF  Voltage: 6.3V  Dielectric: X5R  [C0603]  (hidden comment: CAP_NP_2)
C46  value 100nF  Voltage: 16V  Dielectric: X5R  [C0402]  (hidden comment: CAP_NP_2)
C47  value 10uF  Voltage: 6.3V  Dielectric: X5R  [C0603]  (hidden comment: CAP_NP_2)
C48  value 100nF  Dielectric: X5R  Voltage: 16V  [C0402]  (hidden comment: CAP_NP_2)
C78  value 100nF  Dielectric: X5R  Voltage: 16V  [C0402]  (hidden comment: CAP_NP_2)
C81  value 4.7uF  Dielectric: X5R  Voltage: 10V  [C0402]  (hidden comment: CAP_NP_2)
C82  value 100nF  Voltage: 16V  Dielectric: X5R  [C0402]  (hidden comment: CAP_NP_2)
C84  value 100nF  Dielectric: X5R  Voltage: 16V  [C0402]  (hidden comment: CAP_NP_2)
C93  value 100nF  Dielectric: X5R  Voltage: 16V  [C0402]  (hidden comment: CAP_NP_2)
U6  RK3308  [BGA355_13R00X13R00]  (parts L,M,N of 14)

### Nets
GND: C45.2 C46.2 C47.2 C48.2 C78.2 C81.2 C82.2 C84.2 C93.2 U6.A1(VSS_1) U6.A4(VSS_2) U6.A9(VSS_3) U6.A20(VSS_96) U6.B8(VSS_4) U6.B11(VSS_5) U6.C4(VSS_6) U6.C6(VSS_7) U6.C7(VSS_8) U6.C11(VSS_9) U6.C13(VSS_97) U6.C17(VSS_98) U6.D2(VSS_10) U6.D11(VSS_20) U6.D12(VSS_21) U6.D20(VSS_99) U6.E1(VSS_11) U6.E5(VSS_12) U6.E9(VSS_13) U6.E11(VSS_22) U6.E12(VSS_23) U6.E13(VSS_24) U6.E18(VSS_33) U6.F2(VSS_14) U6.F13(VSS_25) U6.F14(VSS_26) U6.F15(VSS_27) U6.F16(VSS_28) U6.G3(VSS_15) U6.G8(VSS_29) U6.G9(VSS_30) U6.G13(VSS_31) U6.G14(VSS_32) U6.H7(VSS_34) U6.H8(VSS_35) U6.H9(VSS_36) U6.H10(VSS_37) U6.H11(VSS_38) U6.H12(VSS_39) U6.H13(VSS_40) U6.H17(VSS_100) U6.J5(VSS_16) U6.J7(VSS_41) U6.J8(VSS_42) U6.J9(VSS_43) U6.J10(VSS_44) U6.J11(VSS_45) U6.J12(VSS_46) U6.J13(VSS_47) U6.K1(VSS_17) U6.K3(VSS_18) U6.K7(VSS_48) U6.K8(VSS_49) U6.K9(VSS_50) U6.K10(VSS_51) U6.K11(VSS_52) U6.K12(VSS_53) U6.K13(VSS_54) U6.K14(VSS_55) U6.K15(VSS_56) U6.K16(VSS_57) U6.K17(VSS_58) U6.L5(VSS_19) U6.L7(VSS_59) U6.L8(VSS_60) U6.L9(VSS_61) U6.L10(VSS_62) U6.L11(VSS_63) U6.L12(VSS_64) U6.L13(VSS_65) U6.L14(VSS_66) U6.L15(VSS_67) U6.L16(VSS_68) U6.M4(VSS_69) U6.M5(VSS_70) U6.M6(VSS_71) U6.M7(VSS_72) U6.M8(VSS_73) U6.M9(VSS_74) U6.M10(VSS_75) U6.M11(VSS_76) U6.M12(VSS_77) U6.M13(VSS_78) U6.M14(VSS_79) U6.M15(VSS_80) U6.N1(VSS_101) U6.N9(VSS_81) U6.N10(VSS_82) U6.N11(VSS_83) U6.N12(VSS_84) U6.N13(VSS_85) U6.N14(VSS_86) U6.N15(VSS_87) U6.P8(VSS_88) U6.P9(VSS_89) U6.P10(VSS_90) U6.P11(VSS_91) U6.P12(VSS_92) U6.P13(VSS_93) U6.P14(VSS_94) U6.P15(VSS_95) U6.R7(VSS_102) U6.R14(VSS_103) U6.T7(VSS_104) U6.U17(VSS_105) U6.Y1(VSS_106)
VDD_CORE: C45.1 C46.1 C78.1 C81.1 C82.1 C84.1 U6.N6(VDD_CORE_1) U6.N7(VDD_CORE_2) U6.N8(VDD_CORE_3) U6.P5(VDD_CORE_4) U6.P6(VDD_CORE_5) U6.P7(VDD_CORE_6) U6.R5(VDD_CORE_7) U6.R6(VDD_CORE_8) U6.R8(VDD_CORE_9)
VDD_LOG: C47.1 C48.1 C93.1 U6.F10(VDD_LOGIC_1) U6.F11(VDD_LOGIC_2) U6.F12(VDD_LOGIC_3) U6.G10(VDD_LOGIC_4) U6.G11(VDD_LOGIC_5) U6.G12(VDD_LOGIC_6)

### Notes on the sheet
- RK3308 Part-L
- RK3308 Part-N
- RK3308 Part-M
- Trace>60mil(Max 1.5A)
- Trace>30mil(Max 0.5A)
- Note:All the Power filter capacitors should be
- placed close to the power pins of RK3308
- Title
- Size:
- Date:
- A3
- Engineer:
- Time:
- Revision:
- Sheet
- of
- File:

### Library data of the parts
C45 = CAP_NP_2: cap,22.00uF,+/-20%,6.3V,X5R,C0603; Manufacturer_PN: C1608X5R0J226M080AC; Manufacturer: TDK; Created_by: JJJ; Tolerance: 20%; Priority: A; Source_Path: Z:\RK_STANDARD_LIBRARY\CADENCE_CIS\RK_DISCRETE.OLB; number: 1; PCB DECAL: C0603; Part_Type: C0603; RK_PN: C1608X5R0J226M080AC
C46 C82 = CAP_NP_2: cap,100.00nF,+/-10%,16V,X5R,C0402; Manufacturer_PN: C1005X5R1C104K050BA; Manufacturer: TDK; Created_by: JJJ; Tolerance: 10%; Priority: A; Source_Path: Z:\RK_STANDARD_LIBRARY\CADENCE_CIS\RK_DISCRETE.OLB; Number: 1; PCB DECAL: C0402; Part_Type: C0402; RK_PN: C1005X5R1C104K050BA
C47 = CAP_NP_2: cap,10.00uF,+/-10%,6.3V,X5R,C0603; Manufacturer_PN: C1608X5R0J106K080AB; Manufacturer: TDK; Created_by: JJJ; Tolerance: 10%; Priority: A; Source_Path: Z:\RK_STANDARD_LIBRARY\CADENCE_CIS\RK_DISCRETE.OLB; Number: 1; PCB DECAL: C0603; Part_Type: C0603; RK_PN: C1608X5R0J106K080AB; C_Voltage: 6.3V
C48 C78 C84 C93 = CAP_NP_2: cap,100.00nF,+/-10%,16V,X5R,C0402; Manufacturer: TDK; RK_PN: C1005X5R1C104K050BA; Priority: A; Tolerance: 10%; Created_by: JJJ; Source_Path: Z:\RK_STANDARD_LIBRARY\CADENCE_CIS\RK_DISCRETE.OLB; Number: 1; PCB DECAL: C0402; Part_Type: C0402; Manufacturer_PN: C1005X5R1C104K050BA
C81 = CAP_NP_2: cap,4.70uF,+/-10%,10V,X5R,C0402; Manufacturer: TDK; RK_PN: C1005X5R1A475K050BC; Priority: A; Tolerance: 10%; Created_by: JJJ; Source_Path: Z:\RK_STANDARD_LIBRARY\CADENCE_CIS\RK_DISCRETE.OLB; Number: 1; Part_Type: C0402; Manufacturer_PN: C1005X5R1A475K050BC; PCB DECAL: C0402
U6 = RK3308: Manufacturer: ROCKCHIP; Source_Path: E:\SCHEMETIC\RKSCH.OLB; Number: 1; PCB DECAL: BGA355_13R00X13R00; Value: RK3308; Manufacturer_PN: RK3308

## Sheet 05_OSC_PLL.SchDoc: R01L_F
size A3; Organization: 六零加智能科技; Address4: www.nidone.com.cn; DocumentNumber: kang jin; Revision: 1.0; SheetNumber: 5; SheetTotal: 23
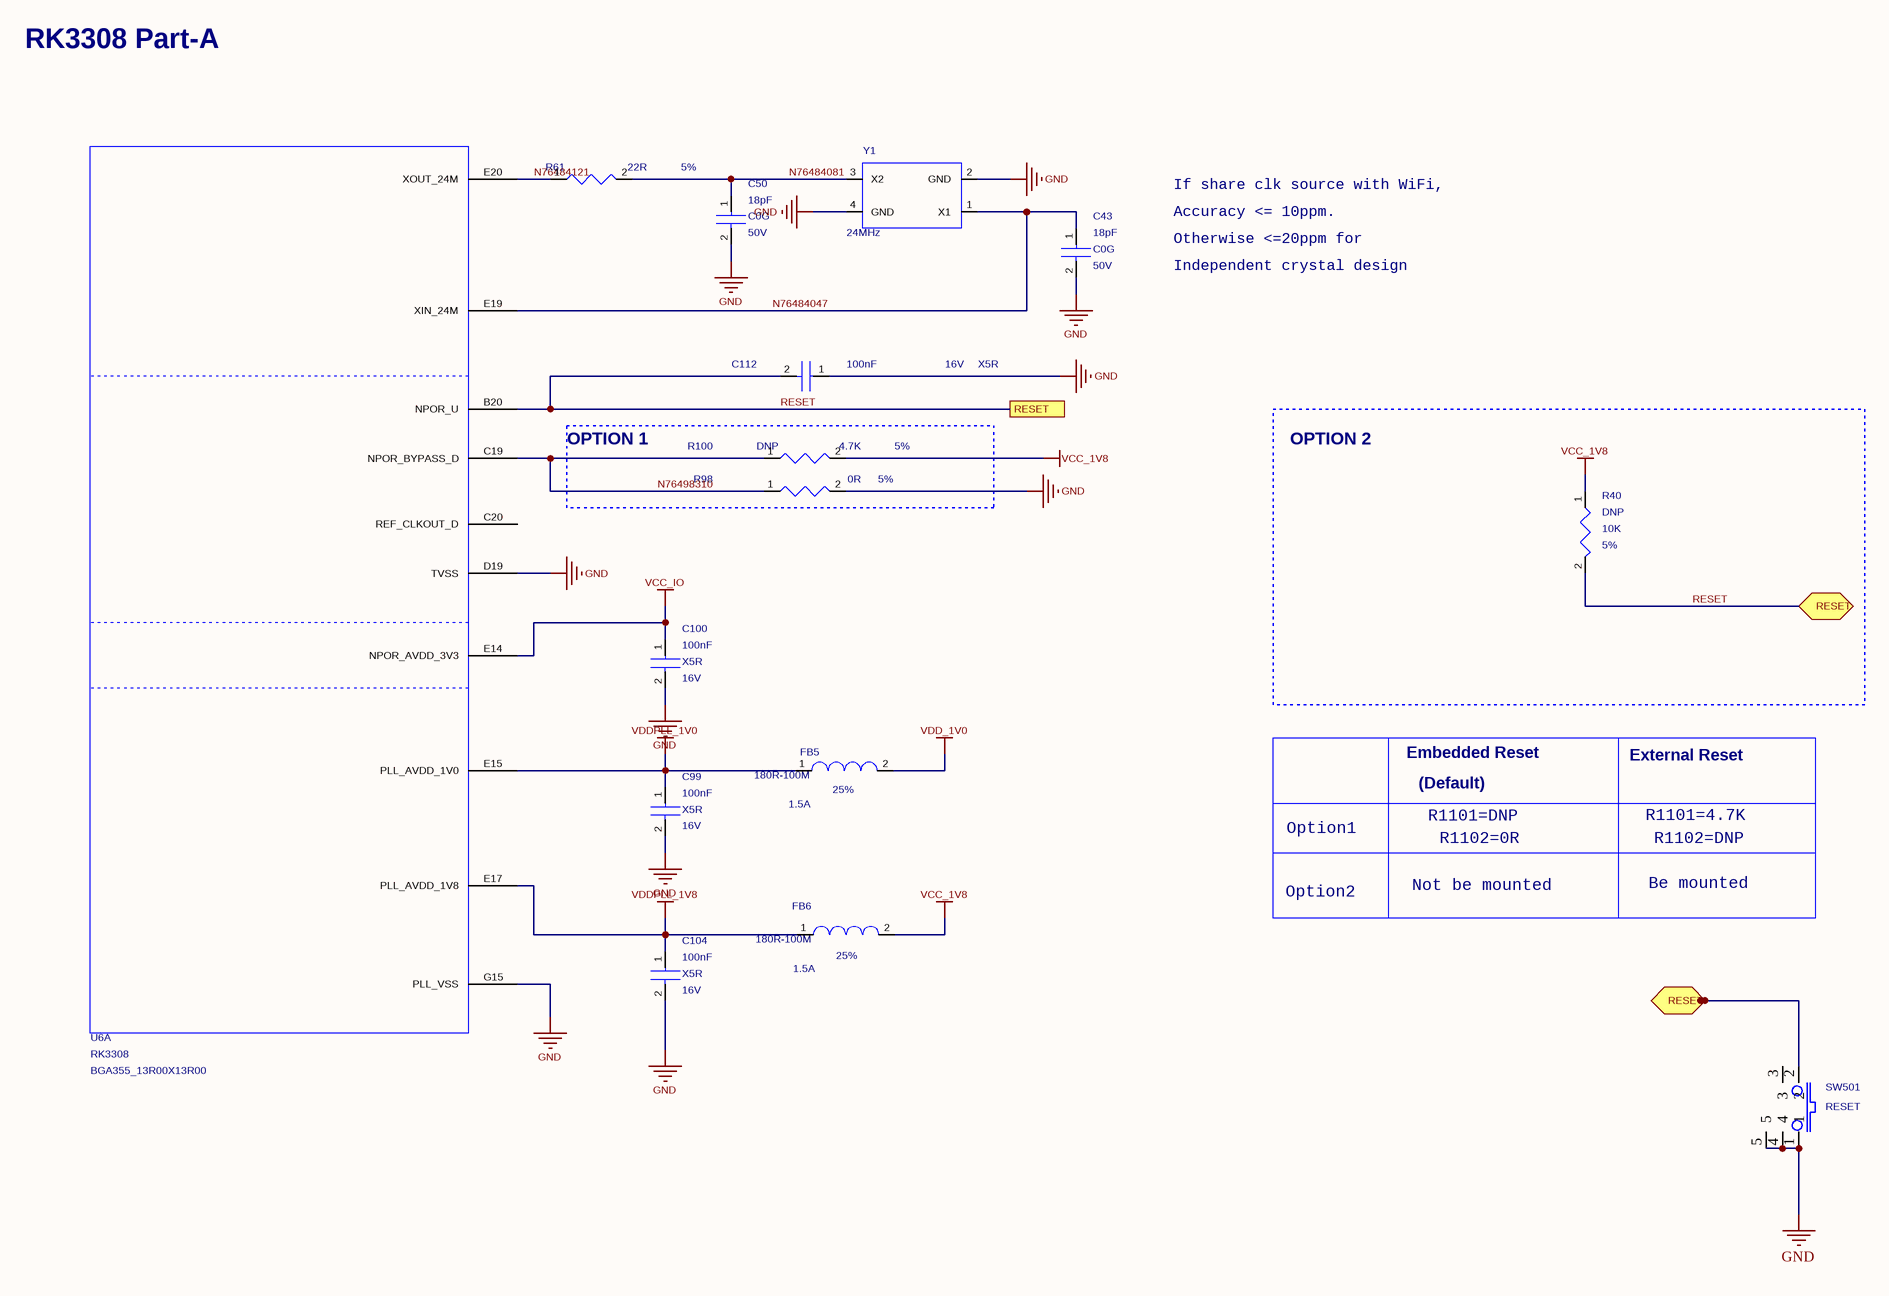
[diagram p12: 05_OSC_PLL.SchDoc]

### Parts
C43  value 18pF  Dielectric: C0G  Voltage: 50V  [C0402]  (hidden comment: CAP_NP_2)
C50  value 18pF  Dielectric: C0G  Voltage: 50V  [C0402]  (hidden comment: CAP_NP_2)
C99  value 100nF  Voltage: 16V  Dielectric: X5R  [C0402]  (hidden comment: CAP_NP_2)
C100  value 100nF  Voltage: 16V  Dielectric: X5R  [C0402]  (hidden comment: CAP_NP_2)
C104  value 100nF  Voltage: 16V  Dielectric: X5R  [C0402]  (hidden comment: CAP_NP_2)
C112  value 100nF  Dielectric: X5R  Voltage: 16V  [C0402]  (hidden comment: CAP_NP_2)
FB5  value 180R-100M  Tolerance: 25%  Irms: 1.5A  [L0603]  (hidden comment: BEAD)
FB6  value 180R-100M  Tolerance: 25%  Irms: 1.5A  [L0603]  (hidden comment: BEAD)
R40  value 10K  OPTION: DNP  Tolerance: 5%  [R0402]  (hidden comment: RESISTOR)
R61  value 22R  Tolerance: 5%  [R0402]  (hidden comment: RESISTOR)
R98  value 0R  Tolerance: 5%  [R0402]  (hidden comment: RESISTOR)
R100  value 4.7K  Tolerance: 5%  OPTION: DNP  [R0402]  (hidden comment: RESISTOR)
SW501  RESET  [SW-TS]
U6  RK3308  [BGA355_13R00X13R00]  (part A of 14)
Y1  value 24MHz  [CRY4_3R20X2R50X0R80]  (hidden comment: CRYSTAL_4P)

### Blocks framed on the sheet
OPTION 2: R40
OPTION 1: R98 R100

### Ports
RESET, RESET (bidir)

### Nets
GND: C43.2 C50.2 C99.2 C100.2 C104.2 C112.1 R98.2 SW501.1 SW501.4 SW501.5 U6.D19(TVSS) U6.G15(PLL_VSS) Y1.2(GND) Y1.4(GND)
VCC_1V8: FB6.2 R40.1 R100.2
VCC_IO: C100.1 U6.E14(NPOR_AVDD_3V3)
VDD_1V0: FB5.2
VDDPLL_1V0: C99.1 FB5.1 U6.E15(PLL_AVDD_1V0)
VDDPLL_1V8: C104.1 FB6.1 U6.E17(PLL_AVDD_1V8)
N76484047: C43.1 U6.E19(XIN_24M) Y1.1(X1)
N76484081: C50.1 R61.2 Y1.3(X2)
N76484121: R61.1 U6.E20(XOUT_24M)
N76498310: R98.1 R100.1 U6.C19(NPOR_BYPASS_D)
RESET: C112.2 R40.2 SW501.2 U6.B20(NPOR_U) ; port RESET

Not connected (* = marked no-connect by the designer): SW501 3; U6 C20(REF_CLKOUT_D)

### Notes on the sheet
- RK3308 Part-A
- If share clk source with WiFi,
- Accuracy <= 10ppm.
- Otherwise <=20ppm for
- Independent crystal design
- Embedded Reset
- External Reset
- Option1
- (Default)
- R1101=DNP
- R1102=0R
- R1101=4.7K
- R1102=DNP
- Option2
- Not be mounted
- Be mounted
- Title
- Size:
- Date:
- A3
- Engineer:
- Time:
- Revision:
- Sheet
- of
- File:

### Library data of the parts
C43 C50 = CAP_NP_2: cap,18.00pF,+/-5%,50V,C0G,C0402; Manufacturer: TDK; RK_PN: C1005C0G1H180J050BA; Priority: A; Tolerance: 5%; Created_by: JJJ; Source_Path: Z:\RK_STANDARD_LIBRARY\CADENCE_CIS\RK_DISCRETE.OLB; PCB DECAL: C0402; Part_Type: C0402; C_Voltage: 50V; Manufacturer_PN: C1005C0G1H180J050BA
C99 C100 C104 = CAP_NP_2: as C46 on sheet 04_POWER; PCB DECAL: C0402; Part_Type: C0402; RK_PN: C1005X5R1C104K050BA
C112 = CAP_NP_2: as C48 on sheet 04_POWER; PCB DECAL: C0402; Part_Type: C0402; Manufacturer_PN: C1005X5R1C104K050BA
FB5 FB6 = BEAD: Ferrite Bead,180R-100M,0.25,L0603; Manufacturer: Murata; RK_PN: BLM18PG181SN1; Priority: A; DC_Resistor: 0.09ohm; Created_by: YTL; Source_Path: Z:\RK_STANDARD_LIBRARY\CADENCE_CIS\RK_DISCRETE.OLB; PCB DECAL: L0603; Part_Type: BEAD; Manufacturer_PN: BLM18PG181SN1
R40 = RESISTOR: ?用厚膜电阻,10K,+/-5%,R0402,1/16W.; Manufacturer_PN: RC0402JR-0710KL; Manufacturer: YAGEO; Created_by: YTL; Wattage: 1/16W; Priority: A; Source_Path: Z:\RK_STANDARD_LIBRARY\CADENCE_CIS\RK_DISCRETE.OLB; PCB DECAL: R0402; Part_Type: ?用厚膜电阻; RK_PN: RC0402JR-0710KL
R61 = RESISTOR: ?用厚膜电阻,22R,+/-5%,R0402,1/16W.; Manufacturer_PN: RC0402JR-0722RL; Manufacturer: YAGEO; Created_by: YTL; Wattage: 1/16W; Priority: A; Source_Path: Z:\RK_STANDARD_LIBRARY\CADENCE_CIS\RK_DISCRETE.OLB; number: 1; PCB DECAL: R0402; Part_Type: ?用厚膜电阻; RK_PN: RC0402JR-0722RL
R98 = RESISTOR: ?用厚膜电阻,0R,+/-5%,R0402,1/16W.; Manufacturer_PN: RC0402JR-070RL; Manufacturer: YAGEO; Created_by: YTL; Wattage: 1/16W; Priority: A; Source_Path: Z:\RK_STANDARD_LIBRARY\CADENCE_CIS\RK_DISCRETE.OLB; Number: 1; PCB DECAL: R0402; Part_Type: ?用厚膜电阻; RK_PN: RC0402JR-070RL
R100 = RESISTOR: ?用厚膜电阻,4K7,+/-5%,R0402,1/16W.; Manufacturer_PN: RC0402JR-074K7L; Manufacturer: YAGEO; Created_by: YTL; Wattage: 1/16W; Priority: A; Source_Path: Z:\RK_STANDARD_LIBRARY\CADENCE_CIS\RK_DISCRETE.OLB; PCB DECAL: R0402; Part_Type: ?用厚膜电阻; RK_PN: RC0402JR-074K7L
SW501 = KEY_5PIN: TS-1086EV-AR03526; pin to pad: 1>2 2>1; Manufacturer: 褀华电子; RK PN: TS-1125S; Priority: A; Part Type: KEY; Manufacturer Part Number: TS-1125S; Created by: YWQ
U6 = RK3308: as U6 on sheet 04_POWER; PCB DECAL: BGA355_13R00X13R00; Value: RK3308; Manufacturer_PN: RK3308
Y1 = CRYSTAL_4P: 无源晶振，24M，3225,±10ppm，12pF，Hosonic; Manufacturer: Hosonic(鸿星电子); RK_PN: E3SB24.0000F12E11; Priority: A; Created_by: JJJ; Source_Path: Z:\RK_STANDARD_LIBRARY\CADENCE_CIS\RK_DISCRETE.OLB; Number: 1; PCB DECAL: CRY4_3R20X2R50X0R80; Part_Type: CRYSTAL; Manufacturer_PN: E3SB24.0000F12E11

## Sheet 06_DDR_CONTROLLER.SchDoc: R01L_F
size A3; Organization: 六零加智能科技有限公司; Address4: www.nidone.com.cn; DocumentNumber: kang jin; Revision: 1.0; SheetNumber: 6; SheetTotal: 23
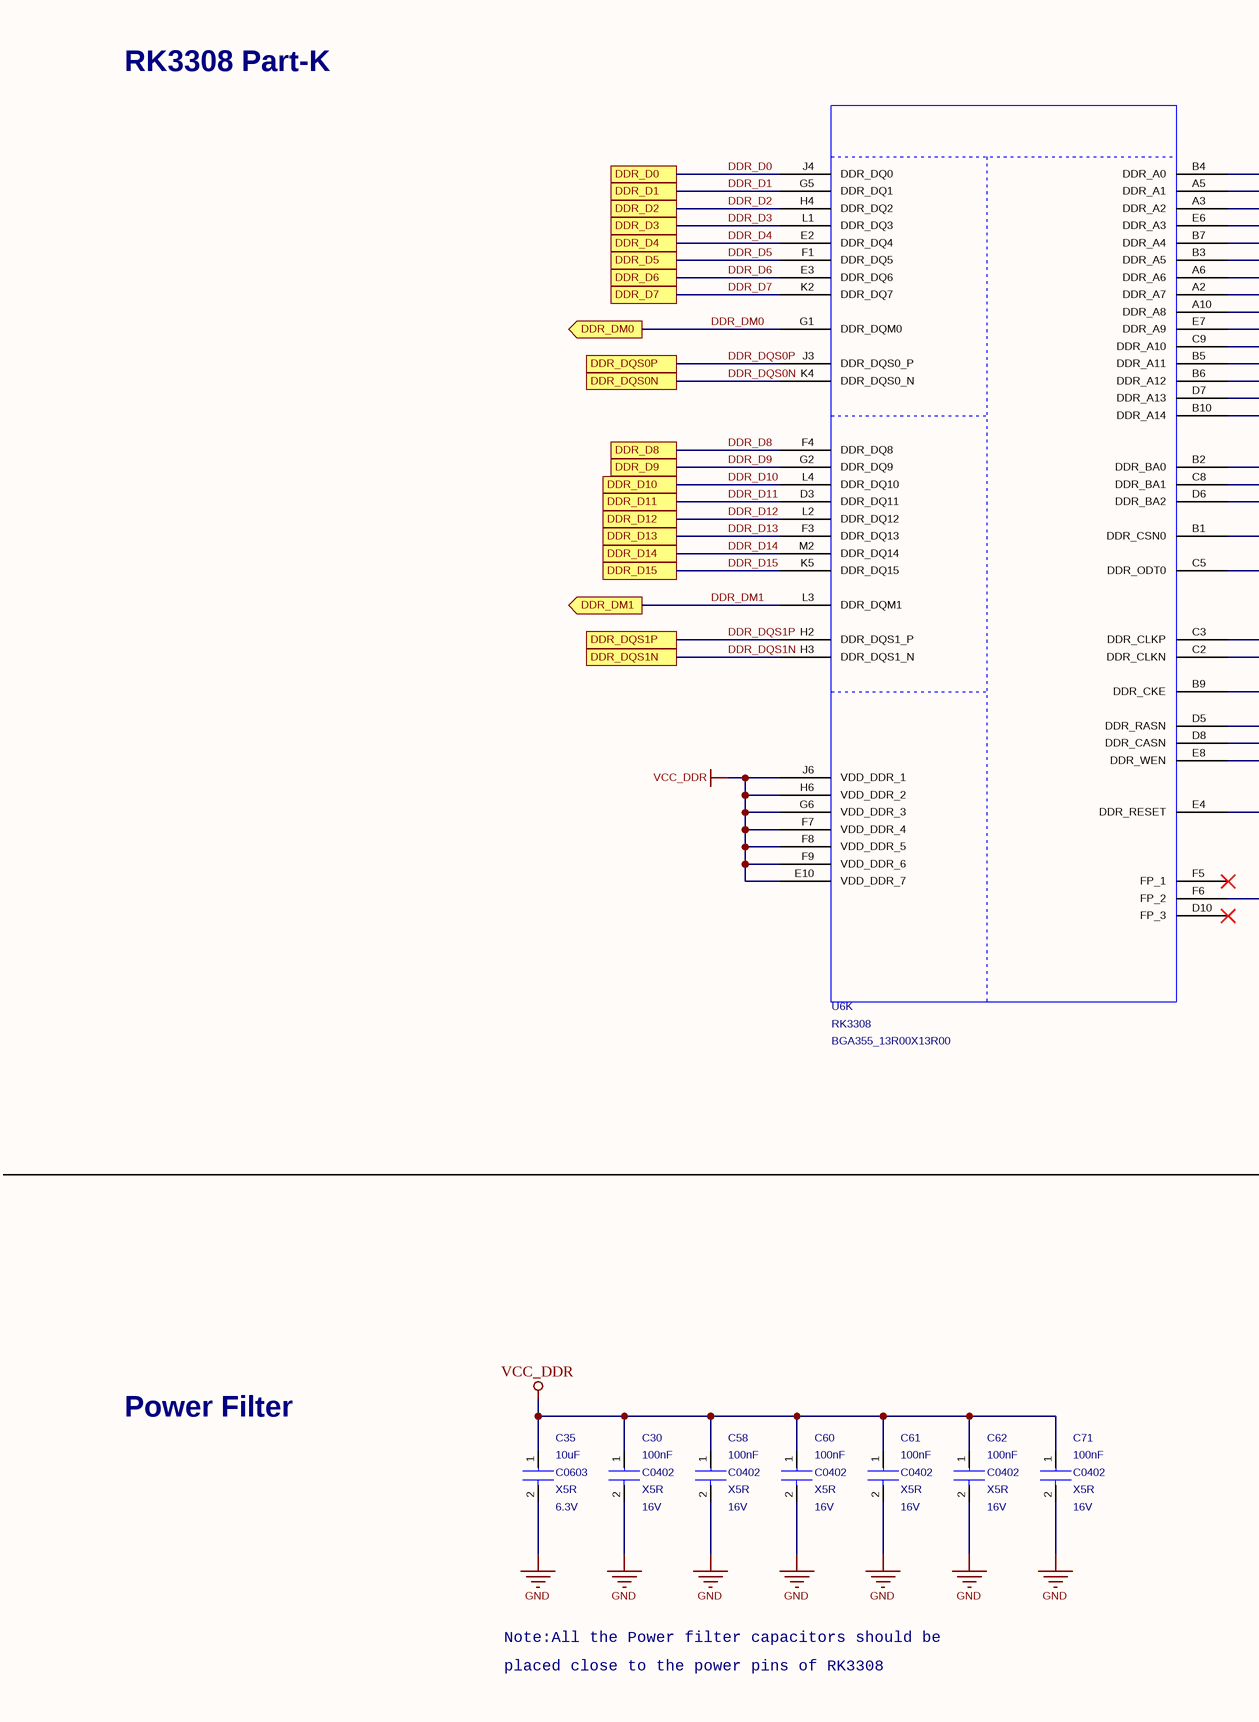
[diagram p13: 06_DDR_CONTROLLER.SchDoc, left]
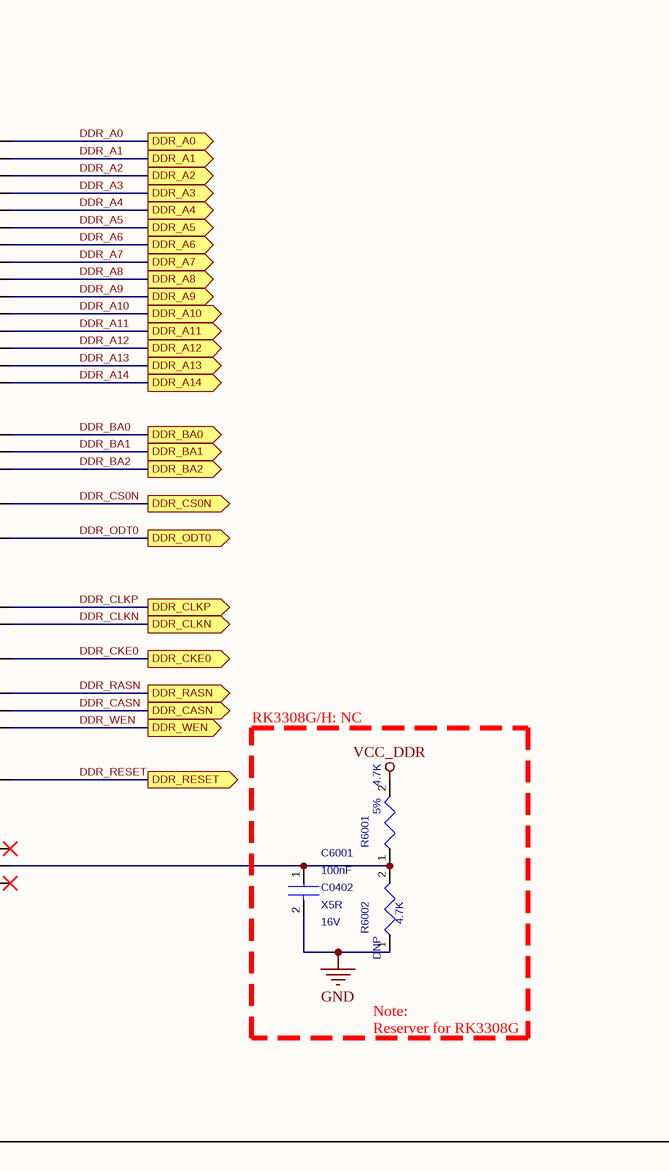
[diagram p14: 06_DDR_CONTROLLER.SchDoc, right]

### Parts
C30  value 100nF  Voltage: 16V  Dielectric: X5R  [C0402]  (hidden comment: CAP_NP_2)
C35  value 10uF  Dielectric: X5R  Voltage: 6.3V  [C0603]  (hidden comment: CAP_NP_2)
C58  value 100nF  Dielectric: X5R  Voltage: 16V  [C0402]  (hidden comment: CAP_NP_2)
C60  value 100nF  Voltage: 16V  Dielectric: X5R  [C0402]  (hidden comment: CAP_NP_2)
C61  value 100nF  Voltage: 16V  Dielectric: X5R  [C0402]  (hidden comment: CAP_NP_2)
C62  value 100nF  Voltage: 16V  Dielectric: X5R  [C0402]  (hidden comment: CAP_NP_2)
C71  value 100nF  Voltage: 16V  Dielectric: X5R  [C0402]  (hidden comment: CAP_NP_2)
C6001  value 100nF  Voltage: 16V  Dielectric: X5R  [C0402]  (hidden comment: CAP_NP_2)
R6001  value 4.7K  [R0402]  (hidden comment: RESISTOR)
R6002  value 4.7K  Tolerance: 5%  OPTION: DNP  [R0402]  (hidden comment: RESISTOR)
U6  RK3308  [BGA355_13R00X13R00]  (part K of 14)

### Ports
DDR_A0 (out), DDR_A1 (out), DDR_A2 (out), DDR_A3 (out), DDR_A4 (out), DDR_A5 (out), DDR_A6 (out), DDR_A7 (out), DDR_A8 (out), DDR_A9 (out), DDR_A10 (out), DDR_A11 (out), DDR_A12 (out), DDR_A13 (out), DDR_A14 (out), DDR_BA0 (out), DDR_BA1 (out), DDR_BA2 (out), DDR_CASN (out), DDR_CKE0 (out), DDR_CLKN (out), DDR_CLKP (out), DDR_CS0N (out), DDR_D0, DDR_D1, DDR_D2, DDR_D3, DDR_D4, DDR_D5, DDR_D6, DDR_D7, DDR_D8, DDR_D9, DDR_D10, DDR_D11, DDR_D12, DDR_D13, DDR_D14, DDR_D15, DDR_DM0 (out), DDR_DM1 (out), DDR_DQS0N, DDR_DQS0P, DDR_DQS1N, DDR_DQS1P, DDR_ODT0 (out), DDR_RASN (out), DDR_RESET (out), DDR_WEN (out)

### Nets
GND: C30.2 C35.2 C58.2 C60.2 C61.2 C62.2 C71.2 C6001.2 R6002.1
VCC_DDR: C30.1 C35.1 C58.1 C60.1 C61.1 C62.1 C71.1 R6001.2 U6.E10(VDD_DDR_7) U6.F7(VDD_DDR_4) U6.F8(VDD_DDR_5) U6.F9(VDD_DDR_6) U6.G6(VDD_DDR_3) U6.H6(VDD_DDR_2) U6.J6(VDD_DDR_1)
DDR_A0: U6.B4(DDR_A0) ; port DDR_A0
DDR_A1: U6.A5(DDR_A1) ; port DDR_A1
DDR_A2: U6.A3(DDR_A2) ; port DDR_A2
DDR_A3: U6.E6(DDR_A3) ; port DDR_A3
DDR_A4: U6.B7(DDR_A4) ; port DDR_A4
DDR_A5: U6.B3(DDR_A5) ; port DDR_A5
DDR_A6: U6.A6(DDR_A6) ; port DDR_A6
DDR_A7: U6.A2(DDR_A7) ; port DDR_A7
DDR_A8: U6.A10(DDR_A8) ; port DDR_A8
DDR_A9: U6.E7(DDR_A9) ; port DDR_A9
DDR_A10: U6.C9(DDR_A10) ; port DDR_A10
DDR_A11: U6.B5(DDR_A11) ; port DDR_A11
DDR_A12: U6.B6(DDR_A12) ; port DDR_A12
DDR_A13: U6.D7(DDR_A13) ; port DDR_A13
DDR_A14: U6.B10(DDR_A14) ; port DDR_A14
DDR_BA0: U6.B2(DDR_BA0) ; port DDR_BA0
DDR_BA1: U6.C8(DDR_BA1) ; port DDR_BA1
DDR_BA2: U6.D6(DDR_BA2) ; port DDR_BA2
DDR_CASN: U6.D8(DDR_CASN) ; port DDR_CASN
DDR_CKE0: U6.B9(DDR_CKE) ; port DDR_CKE0
DDR_CLKN: U6.C2(DDR_CLKN) ; port DDR_CLKN
DDR_CLKP: U6.C3(DDR_CLKP) ; port DDR_CLKP
DDR_CS0N: U6.B1(DDR_CSN0) ; port DDR_CS0N
DDR_D0: U6.J4(DDR_DQ0) ; port DDR_D0
DDR_D1: U6.G5(DDR_DQ1) ; port DDR_D1
DDR_D2: U6.H4(DDR_DQ2) ; port DDR_D2
DDR_D3: U6.L1(DDR_DQ3) ; port DDR_D3
DDR_D4: U6.E2(DDR_DQ4) ; port DDR_D4
DDR_D5: U6.F1(DDR_DQ5) ; port DDR_D5
DDR_D6: U6.E3(DDR_DQ6) ; port DDR_D6
DDR_D7: U6.K2(DDR_DQ7) ; port DDR_D7
DDR_D8: U6.F4(DDR_DQ8) ; port DDR_D8
DDR_D9: U6.G2(DDR_DQ9) ; port DDR_D9
DDR_D10: U6.L4(DDR_DQ10) ; port DDR_D10
DDR_D11: U6.D3(DDR_DQ11) ; port DDR_D11
DDR_D12: U6.L2(DDR_DQ12) ; port DDR_D12
DDR_D13: U6.F3(DDR_DQ13) ; port DDR_D13
DDR_D14: U6.M2(DDR_DQ14) ; port DDR_D14
DDR_D15: U6.K5(DDR_DQ15) ; port DDR_D15
DDR_DM0: U6.G1(DDR_DQM0) ; port DDR_DM0
DDR_DM1: U6.L3(DDR_DQM1) ; port DDR_DM1
DDR_DQS0N: U6.K4(DDR_DQS0_N) ; port DDR_DQS0N
DDR_DQS0P: U6.J3(DDR_DQS0_P) ; port DDR_DQS0P
DDR_DQS1N: U6.H3(DDR_DQS1_N) ; port DDR_DQS1N
DDR_DQS1P: U6.H2(DDR_DQS1_P) ; port DDR_DQS1P
DDR_ODT0: U6.C5(DDR_ODT0) ; port DDR_ODT0
DDR_RASN: U6.D5(DDR_RASN) ; port DDR_RASN
DDR_RESET: U6.E4(DDR_RESET) ; port DDR_RESET
DDR_WEN: U6.E8(DDR_WEN) ; port DDR_WEN
NetC6001_1: C6001.1 R6001.1 R6002.2 U6.F6(FP_2)

Not connected (* = marked no-connect by the designer): U6 D10(FP_3)* F5(FP_1)*

### Notes on the sheet
- RK3308 Part-K
- RK3308G/H: NC
- Reserver for RK3308G
- Note:
- Power Filter
- Note:All the Power filter capacitors should be
- placed close to the power pins of RK3308
- Title
- Size:
- Date:
- A3
- Engineer:
- Time:
- Revision:
- Sheet
- of
- File:

### Library data of the parts
C30 = CAP_NP_2: cap,100.00nF,+/-10%,16V,X5R,C0402; Manufacturer_PN: C1005X5R1C104K050BA; Manufacturer: TDK; Created_by: JJJ; Tolerance: 10%; Priority: A; Source_Path: Z:\RK_STANDARD_LIBRARY\CADENCE_CIS\RK_DISCRETE.OLB; Number: 1; C_Voltage: 6.3V; PCB DECAL: C0402; Part_Type: C0402; RK_PN: C1005X5R1C104K050BA
C35 = CAP_NP_2: as C300 on sheet 03a_POWER-DISCRETE; PCB DECAL: C0603; Part_Type: C0603; Manufacturer_PN: C1608X5R0J106K080AB; C_Voltage: 6.3V
C58 = CAP_NP_2: as C48 on sheet 04_POWER; PCB DECAL: C0402; Part_Type: C0402; Manufacturer_PN: C1005X5R1C104K050BA
C60-C62 C71 C6001 = CAP_NP_2: as C46 on sheet 04_POWER; PCB DECAL: C0402; Part_Type: C0402; RK_PN: C1005X5R1C104K050BA
R6001 = RESISTOR: ?用厚膜电阻,4K7,+/-5%,R0402,1/16W.; Manufacturer_PN: RC0402JR-074K7L; Manufacturer: YAGEO; Created_by: YTL; Wattage: 1/16W; Tolerance: 5%; Priority: A; OPTION: DNP; Source_Path: Z:\RK_STANDARD_LIBRARY\CADENCE_CIS\RK_DISCRETE.OLB; PCB DECAL: R0402; Part_Type: ?用厚膜电阻; RK_PN: RC0402JR-074K7L
R6002 = RESISTOR: as R100 on sheet 05_OSC_PLL; PCB DECAL: R0402; Part_Type: ?用厚膜电阻; RK_PN: RC0402JR-074K7L
U6 = RK3308: as U6 on sheet 04_POWER; PCB DECAL: BGA355_13R00X13R00; Value: RK3308; Manufacturer_PN: RK3308

## Sheet 07_FLASH_CONTROLLER.SchDoc: R01L_F
size A3; Organization: 六零加智能科技; Address4: www.nidone.com.cn; DocumentNumber: kang jin; Revision: 1.0; SheetNumber: 7; SheetTotal: 23
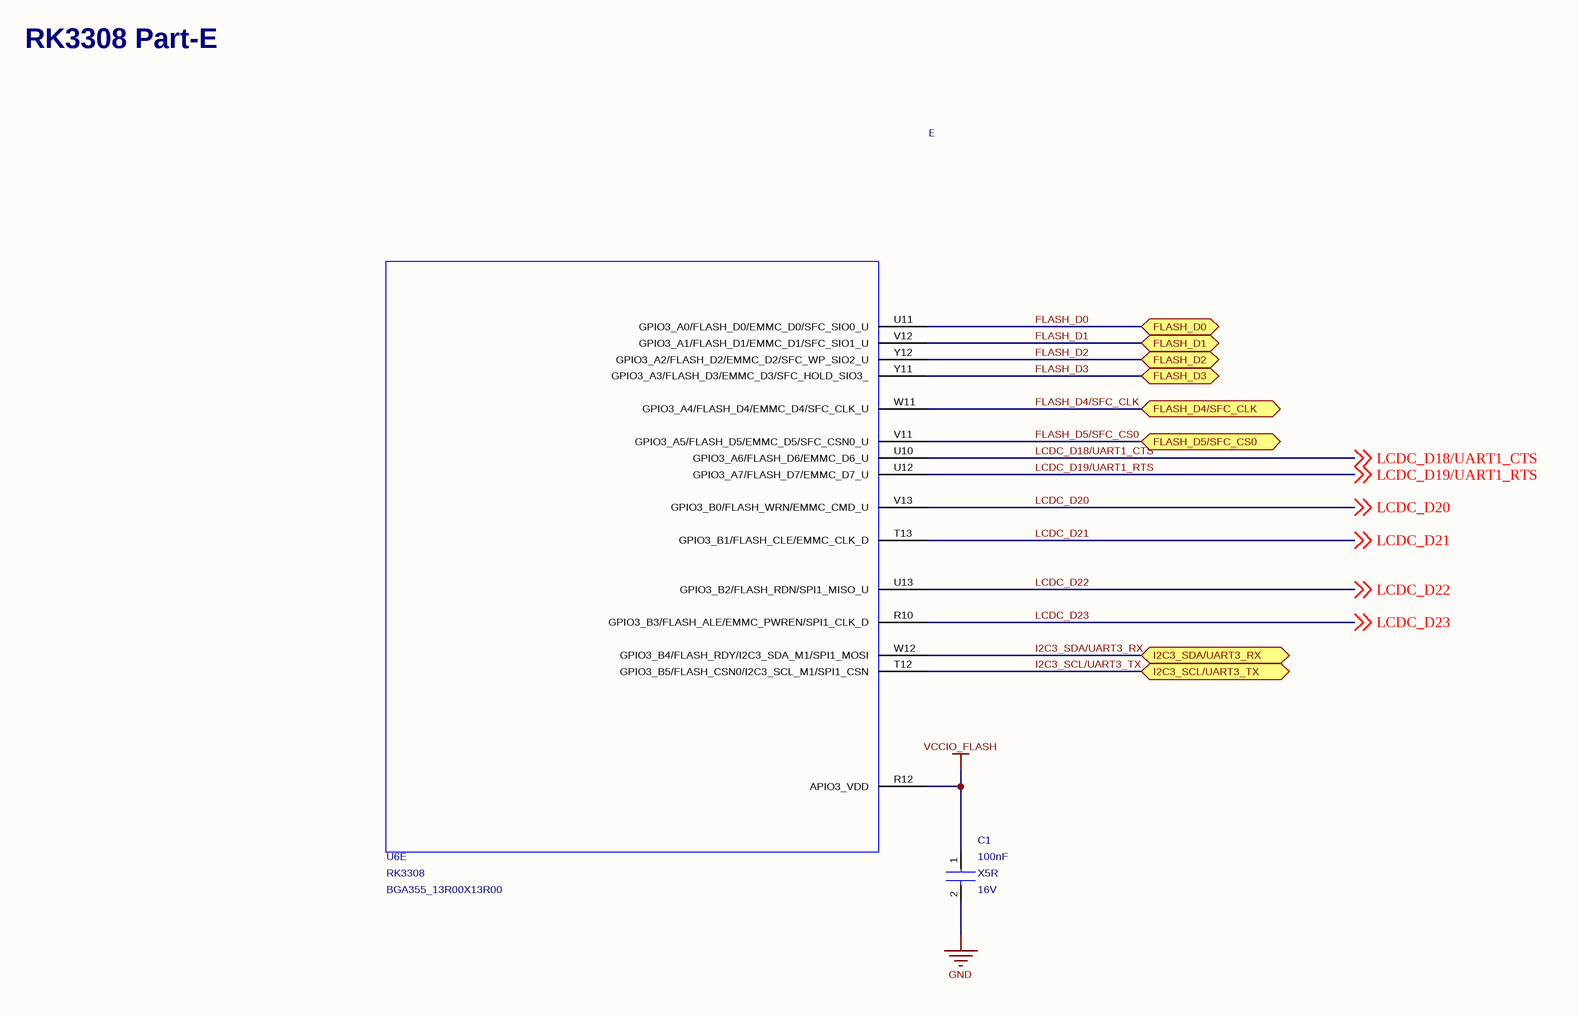
[diagram p15: 07_FLASH_CONTROLLER.SchDoc]

### Parts
C1  value 100nF  Dielectric: X5R  Voltage: 16V  [C0402]  (hidden comment: CAP_NP_2)
U6  RK3308  [BGA355_13R00X13R00]  (part E of 14)

### Ports
FLASH_D0 (bidir), FLASH_D1 (bidir), FLASH_D2 (bidir), FLASH_D3 (bidir), FLASH_D4/SFC_CLK (bidir), FLASH_D5/SFC_CS0 (bidir), I2C3_SCL/UART3_TX (bidir), I2C3_SDA/UART3_RX (bidir)

### Nets
GND: C1.2
VCCIO_FLASH: C1.1 U6.R12(APIO3_VDD)  [project net VCC_IO]
FLASH_D0: U6.U11(GPIO3_A0/FLASH_D0/EMMC_D0/SFC_SIO0_U) ; port FLASH_D0
FLASH_D1: U6.V12(GPIO3_A1/FLASH_D1/EMMC_D1/SFC_SIO1_U) ; port FLASH_D1
FLASH_D2: U6.Y12(GPIO3_A2/FLASH_D2/EMMC_D2/SFC_WP_SIO2_U) ; port FLASH_D2
FLASH_D3: U6.Y11(GPIO3_A3/FLASH_D3/EMMC_D3/SFC_HOLD_SIO3_) ; port FLASH_D3
FLASH_D4/SFC_CLK: U6.W11(GPIO3_A4/FLASH_D4/EMMC_D4/SFC_CLK_U) ; port FLASH_D4/SFC_CLK
FLASH_D5/SFC_CS0: U6.V11(GPIO3_A5/FLASH_D5/EMMC_D5/SFC_CSN0_U) ; port FLASH_D5/SFC_CS0
I2C3_SCL/UART3_TX: U6.T12(GPIO3_B5/FLASH_CSN0/I2C3_SCL_M1/SPI1_CSN) ; port I2C3_SCL/UART3_TX
I2C3_SDA/UART3_RX: U6.W12(GPIO3_B4/FLASH_RDY/I2C3_SDA_M1/SPI1_MOSI) ; port I2C3_SDA/UART3_RX
LCDC_D18/UART1_CTS: U6.U10(GPIO3_A6/FLASH_D6/EMMC_D6_U) ; off-sheet LCDC_D18/UART1_CTS
LCDC_D19/UART1_RTS: U6.U12(GPIO3_A7/FLASH_D7/EMMC_D7_U) ; off-sheet LCDC_D19/UART1_RTS
LCDC_D20: U6.V13(GPIO3_B0/FLASH_WRN/EMMC_CMD_U) ; off-sheet LCDC_D20
LCDC_D21: U6.T13(GPIO3_B1/FLASH_CLE/EMMC_CLK_D) ; off-sheet LCDC_D21
LCDC_D22: U6.U13(GPIO3_B2/FLASH_RDN/SPI1_MISO_U) ; off-sheet LCDC_D22
LCDC_D23: U6.R10(GPIO3_B3/FLASH_ALE/EMMC_PWREN/SPI1_CLK_D) ; off-sheet LCDC_D23

### Notes on the sheet
- RK3308 Part-E
- E
- Title
- Size:
- Date:
- A3
- Engineer:
- Time:
- Revision:
- Sheet
- of
- File:

### Library data of the parts
C1 = CAP_NP_2: as C48 on sheet 04_POWER; PCB DECAL: C0402; Part_Type: C0402; Manufacturer_PN: C1005X5R1C104K050BA
U6 = RK3308: as U6 on sheet 04_POWER; PCB DECAL: BGA355_13R00X13R00; Value: RK3308; Manufacturer_PN: RK3308

## Sheet 08_USB_CONTROLLER.SchDoc: R01L_F
size A3; Organization: 六零加智能科技; Address4: www.nidone.com.cn; DocumentNumber: kang jin; Revision: 1.0; SheetNumber: 8; SheetTotal: 23
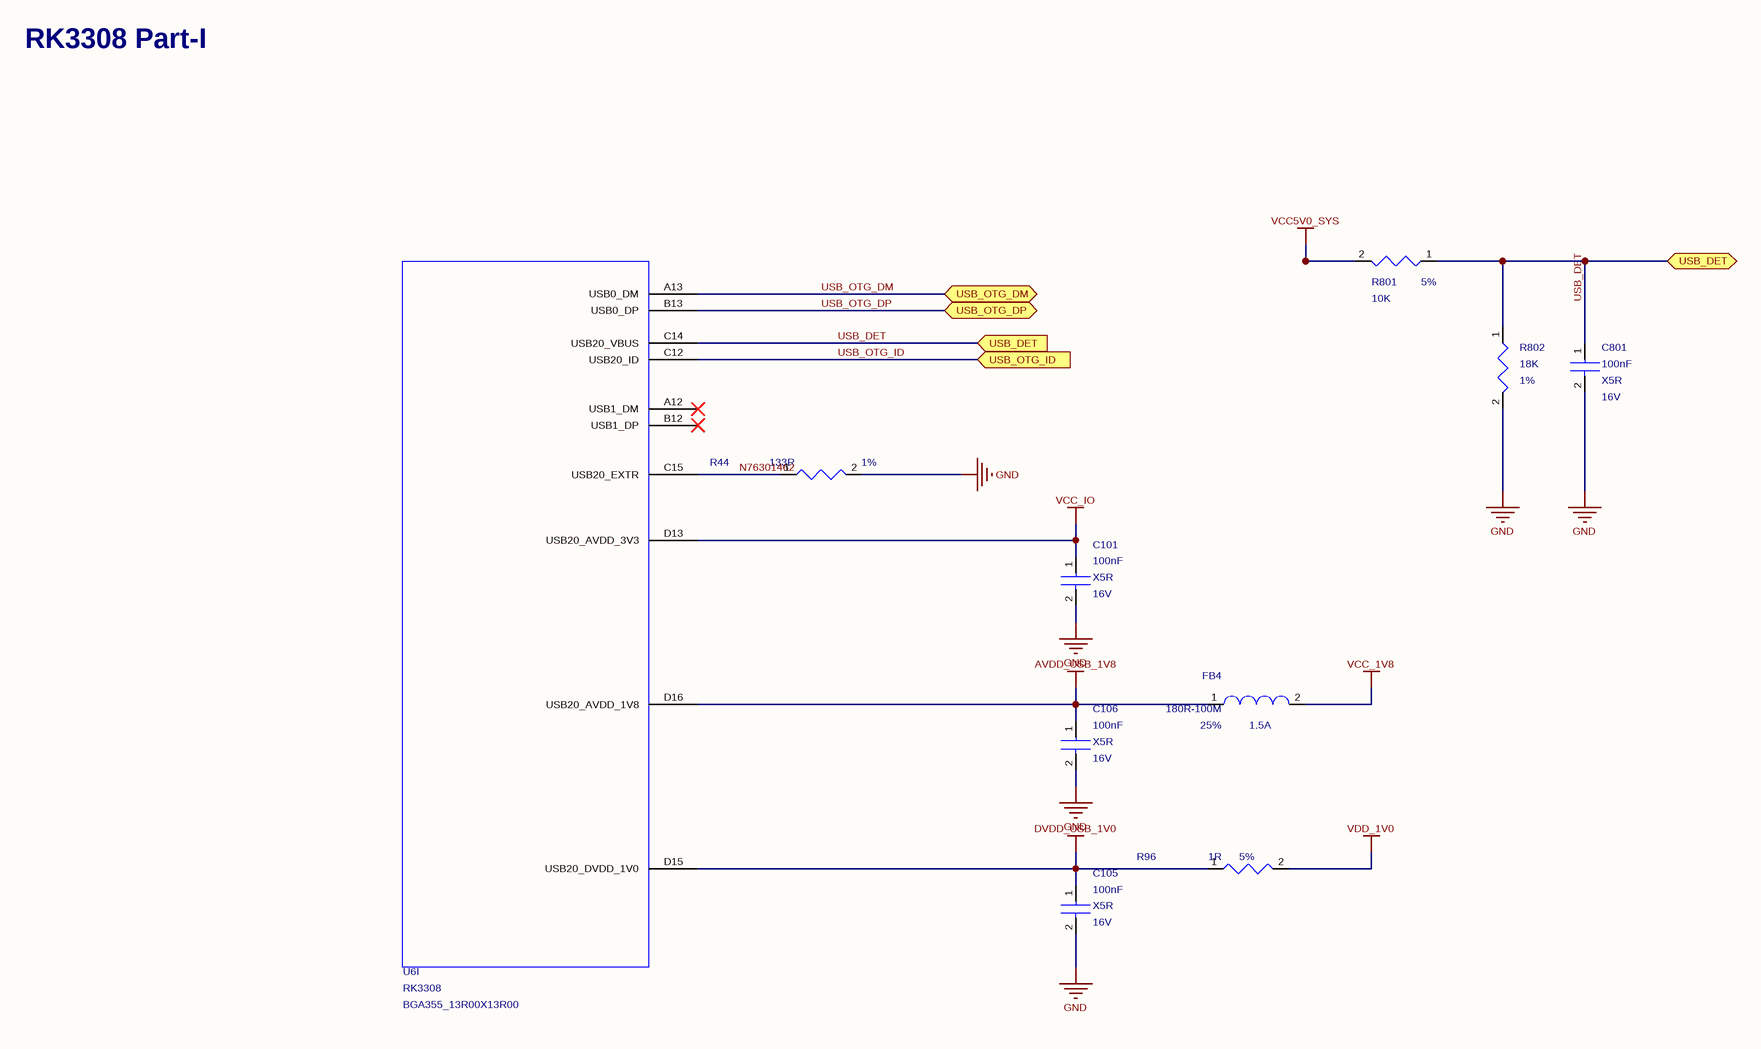
[diagram p16: 08_USB_CONTROLLER.SchDoc]

### Parts
C101  value 100nF  Dielectric: X5R  Voltage: 16V  [C0402]  (hidden comment: CAP_NP_2)
C105  value 100nF  Voltage: 16V  Dielectric: X5R  [C0402]  (hidden comment: CAP_NP_2)
C106  value 100nF  Voltage: 16V  Dielectric: X5R  [C0402]  (hidden comment: CAP_NP_2)
C801  value 100nF  Voltage: 16V  Dielectric: X5R  [C0402]  (hidden comment: CAP_NP_2)
FB4  value 180R-100M  Irms: 1.5A  Tolerance: 25%  [L0603]  (hidden comment: BEAD)
R44  value 133R  Tolerance: 1%  [R0402]  (hidden comment: RESISTOR)
R96  value 1R  Tolerance: 5%  [R0603]  (hidden comment: RESISTOR)
R801  value 10K  Tolerance: 5%  [R0402]  (hidden comment: RESISTOR)
R802  value 18K  Tolerance: 1%  [R0402]  (hidden comment: RESISTOR)
U6  RK3308  [BGA355_13R00X13R00]  (part I of 14)

### Ports
USB_DET (bidir), USB_DET (in), USB_OTG_DM (bidir), USB_OTG_DP (bidir), USB_OTG_ID (in)

### Nets
AVDD_USB_1V8: C106.1 FB4.1 U6.D16(USB20_AVDD_1V8)
DVDD_USB_1V0: C105.1 R96.1 U6.D15(USB20_DVDD_1V0)
GND: C101.2 C105.2 C106.2 C801.2 R44.2 R802.2
VCC5V0_SYS: R801.2
VCC_1V8: FB4.2
VCC_IO: C101.1 U6.D13(USB20_AVDD_3V3)
VDD_1V0: R96.2
N76301462: R44.1 U6.C15(USB20_EXTR)
USB_DET: C801.1 R801.1 R802.1 U6.C14(USB20_VBUS) ; port USB_DET
USB_OTG_DM: U6.A13(USB0_DM) ; port USB_OTG_DM
USB_OTG_DP: U6.B13(USB0_DP) ; port USB_OTG_DP
USB_OTG_ID: U6.C12(USB20_ID) ; port USB_OTG_ID

Not connected (* = marked no-connect by the designer): U6 A12(USB1_DM)* B12(USB1_DP)*

### Notes on the sheet
- RK3308 Part-I
- Title
- Size:
- Date:
- A3
- Engineer:
- Time:
- Revision:
- Sheet
- of
- File:

### Library data of the parts
C101 = CAP_NP_2: as C48 on sheet 04_POWER; PCB DECAL: C0402; Part_Type: C0402; Manufacturer_PN: C1005X5R1C104K050BA
C105 C106 C801 = CAP_NP_2: as C46 on sheet 04_POWER; PCB DECAL: C0402; Part_Type: C0402; RK_PN: C1005X5R1C104K050BA
FB4 = BEAD: Ferrite Bead,180R-100M,0.25,L0603; Manufacturer_PN: BLM18PG181SN1; Manufacturer: Murata; Created_by: YTL; DC_Resistor: 0.09ohm; Priority: A; Source_Path: Z:\RK_STANDARD_LIBRARY\CADENCE_CIS\RK_DISCRETE.OLB; Part_Type: BEAD; RK_PN: BLM18PG181SN1; PCB DECAL: L0603
R44 = RESISTOR: ?用厚膜电阻,133R,+/-1%,R0402,1/16W.; Manufacturer_PN: RC0402FR-07133RL; Manufacturer: YAGEO; Created_by: YTL; Wattage: 1/16W; Priority: A; Source_Path: Z:\RK_STANDARD_LIBRARY\CADENCE_CIS\RK_DISCRETE.OLB; Part_Type: ?用厚膜电阻; RK_PN: RC0402FR-07133RL; PCB DECAL: R0402
R96 = RESISTOR: ?用厚膜电阻,1R,+/-5%,R0603,1/10W.; Manufacturer: YAGEO; RK_PN: RC0603JR-071RL; Priority: A; Wattage: 1/10W; Created_by: YTL; Source_Path: Z:\RK_STANDARD_LIBRARY\CADENCE_CIS\RK_DISCRETE.OLB; PCB DECAL: R0603; Part_Type: ?用厚膜电阻; Manufacturer_PN: RC0603JR-071RL
R801 = RESISTOR: as R40 on sheet 05_OSC_PLL; PCB DECAL: R0402; Part_Type: ?用厚膜电阻; RK_PN: RC0402JR-0710KL
R802 = RESISTOR: ?用厚膜电阻,18K,+/-1%,R0402,1/16W.; Manufacturer: YAGEO; RK_PN: RC0402FR-0718KL; Priority: A; Wattage: 1/16W; Created_by: YTL; Source_Path: Z:\RK_STANDARD_LIBRARY\CADENCE_CIS\RK_DISCRETE.OLB; PCB DECAL: R0402; Part_Type: ?用厚膜电阻; Manufacturer_PN: RC0402FR-0718KL
U6 = RK3308: as U6 on sheet 04_POWER; PCB DECAL: BGA355_13R00X13R00; Value: RK3308; Manufacturer_PN: RK3308

## Sheet 09_SARADC_OTP.SchDoc: R01L_F
size A3; Organization: 六零加智能科技; Address4: www.nidone.com.cn; DocumentNumber: kang jin; Revision: 1.0; SheetNumber: 9; SheetTotal: 23
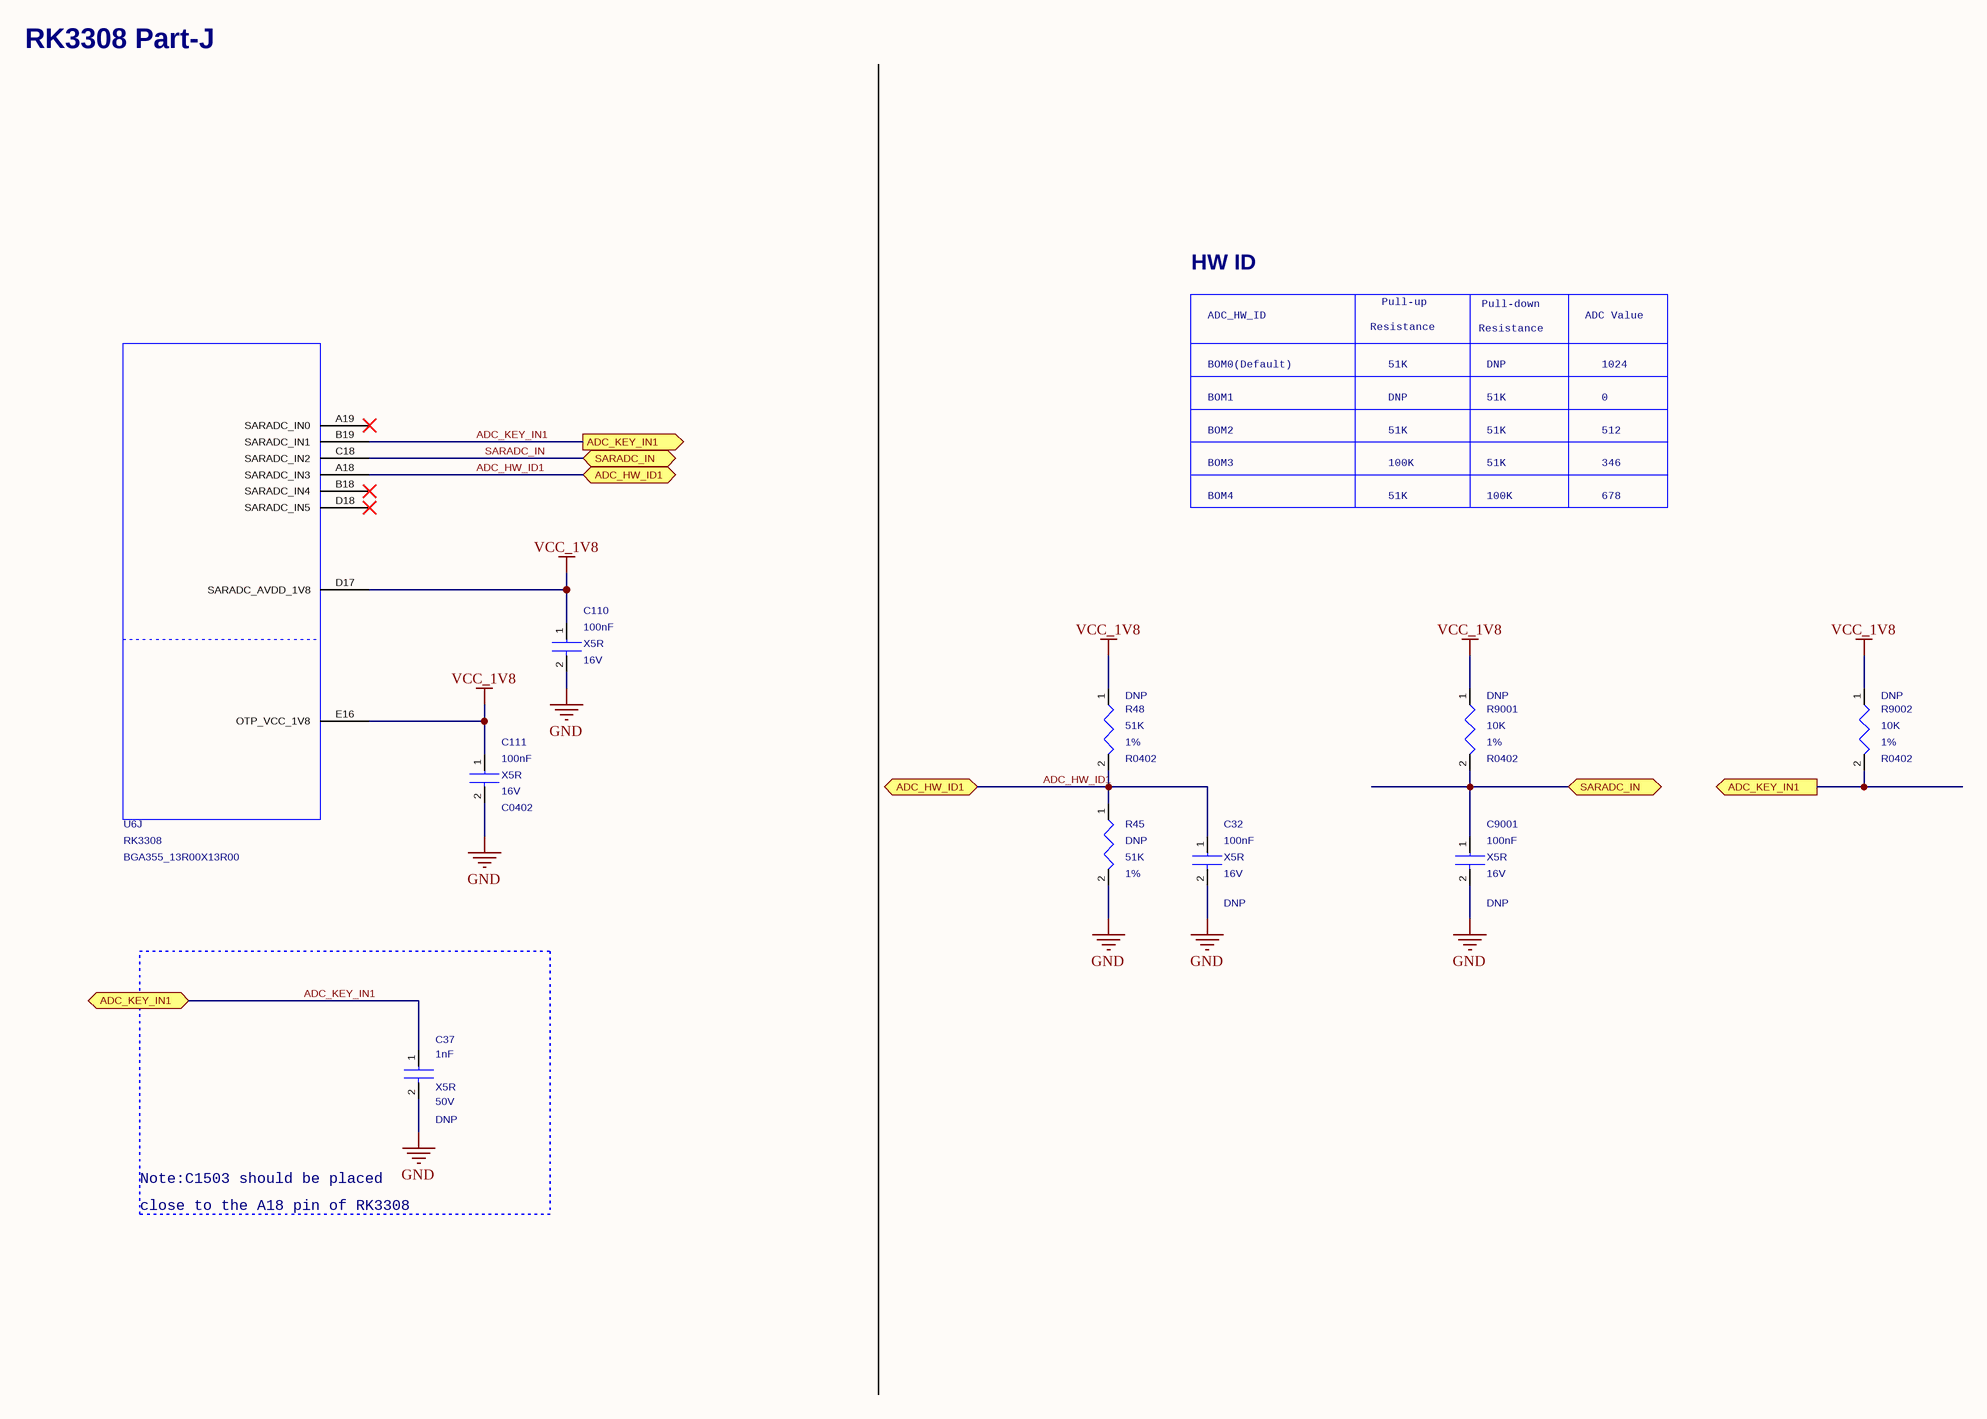
[diagram p17: 09_SARADC_OTP.SchDoc]

### Parts
C32  value 100nF  Dielectric: X5R  Voltage: 16V  Option: DNP  [C0402]  (hidden comment: CAP_NP_2)
C37  value 1nF  Dielectric: X5R  Voltage: 50V  Option: DNP  [C0402]  (hidden comment: CAP_NP_2)
C110  value 100nF  Voltage: 16V  Dielectric: X5R  [C0402]  (hidden comment: CAP_NP_2)
C111  value 100nF  Voltage: 16V  Dielectric: X5R  [C0402]  (hidden comment: CAP_NP_2)
C9001  value 100nF  Dielectric: X5R  Voltage: 16V  Option: DNP  [C0402]  (hidden comment: CAP_NP_2)
R45  value 51K  Option: DNP  Tolerance: 1%  [R0402]  (hidden comment: RESISTOR)
R48  value 51K  Tolerance: 1%  Option: DNP  [R0402]  (hidden comment: RESISTOR)
R9001  value 10K  Tolerance: 1%  Option: DNP  [R0402]  (hidden comment: RESISTOR)
R9002  value 10K  Tolerance: 1%  Option: DNP  [R0402]  (hidden comment: RESISTOR)
U6  RK3308  [BGA355_13R00X13R00]  (part J of 14)

### Ports
ADC_HW_ID1 (bidir), ADC_KEY_IN1 (bidir), ADC_KEY_IN1 (out), SARADC_IN (bidir)

### Nets
GND: C32.2 C37.2 C110.2 C111.2 C9001.2 R45.2
VCC_1V8: C110.1 C111.1 R48.1 R9001.1 R9002.1 U6.D17(SARADC_AVDD_1V8) U6.E16(OTP_VCC_1V8)
ADC_HW_ID1: C32.1 R45.1 R48.2 U6.A18(SARADC_IN3) ; port ADC_HW_ID1
ADC_KEY_IN1: C37.1 R9002.2 U6.B19(SARADC_IN1) ; port ADC_KEY_IN1
SARADC_IN: C9001.1 R9001.2 U6.C18(SARADC_IN2) ; port SARADC_IN

Not connected (* = marked no-connect by the designer): U6 A19(SARADC_IN0)* B18(SARADC_IN4)* D18(SARADC_IN5)*

### Notes on the sheet
- RK3308 Part-J
- HW ID
- ADC_HW_ID
- Resistance
- Pull-up
- Pull-down
- ADC Value
- BOM0(Default)
- BOM1
- DNP
- 51K
- 1024
- 0
- BOM2
- BOM3
- 100K
- 346
- 512
- BOM4
- 678
- Note:C1503 should be placed
- close to the A18 pin of RK3308
- Title
- Size:
- Date:
- A3
- Engineer:
- Time:
- Revision:
- Sheet
- of
- File:

### Library data of the parts
C32 C9001 = CAP_NP_2: cap,100.00nF,+/-10%,16V,X5R,C0402; Manufacturer_PN: C1005X5R1C104K050BA; Manufacturer: TDK; Created_by: JJJ; C_Voltage: 6.3V; Tolerance: 10%; Priority: A; Number: 1; Source_Path: Z:\RK_STANDARD_LIBRARY\CADENCE_CIS\RK_DISCRETE.OLB; Part_Type: C0402; RK_PN: C1005X5R1C104K050BA; PCB DECAL: C0402
C37 = CAP_NP_2: cap,1.00nF,+/-10%,50V,X5R,C0402; Manufacturer: TDK; RK_PN: C1005X5R1H102K050BA; Priority: A; Tolerance: 10%; Created_by: JJJ; Source_Path: Z:\RK_STANDARD_LIBRARY\CADENCE_CIS\RK_DISCRETE.OLB; Number: 1; Part_Type: C0402; Manufacturer_PN: C1005X5R1H102K050BA; PCB DECAL: C0402
C110 C111 = CAP_NP_2: cap,100.00nF,+/-10%,16V,X5R,C0402; Manufacturer: TDK; Number: 1; RK_PN: C1005X5R1C104K050BA; Priority: A; Tolerance: 10%; C_Voltage: 6.3V; Created_by: JJJ; Source_Path: Z:\RK_STANDARD_LIBRARY\CADENCE_CIS\RK_DISCRETE.OLB; PCB DECAL: C0402; Part_Type: C0402; Manufacturer_PN: C1005X5R1C104K050BA
R45 R48 = RESISTOR: ?用厚膜电阻,51K,+/-1%,R0402,1/16W.; Manufacturer_PN: RC0402FR-0751KL; Manufacturer: YAGEO; Created_by: YTL; Wattage: 1/16W; Priority: A; Source_Path: Z:\RK_STANDARD_LIBRARY\CADENCE_CIS\RK_DISCRETE.OLB; Part_Type: ?用厚膜电阻; RK_PN: RC0402FR-0751KL; PCB DECAL: R0402
R9001 R9002 = RESISTOR: ?用厚膜电阻,10K,+/-1%,R0402,1/16W.; Manufacturer_PN: RC0402FR-0751KL; Manufacturer: YAGEO; Created_by: YTL; Wattage: 1/16W; Priority: A; Source_Path: Z:\RK_STANDARD_LIBRARY\CADENCE_CIS\RK_DISCRETE.OLB; Part_Type: ?用厚膜电阻; RK_PN: RC0402FR-0751KL; PCB DECAL: R0402
U6 = RK3308: as U6 on sheet 04_POWER; PCB DECAL: BGA355_13R00X13R00; Value: RK3308; Manufacturer_PN: RK3308

## Sheet 10_LCDC_MAC_I2S1_JTAG.SchDoc: P30L
size A3; Organization: 六零加智能科技; Address4: www.nidone.com.cn; DocumentNumber: Kang jin; Revision: 1.0; SheetNumber: 10; SheetTotal: 23
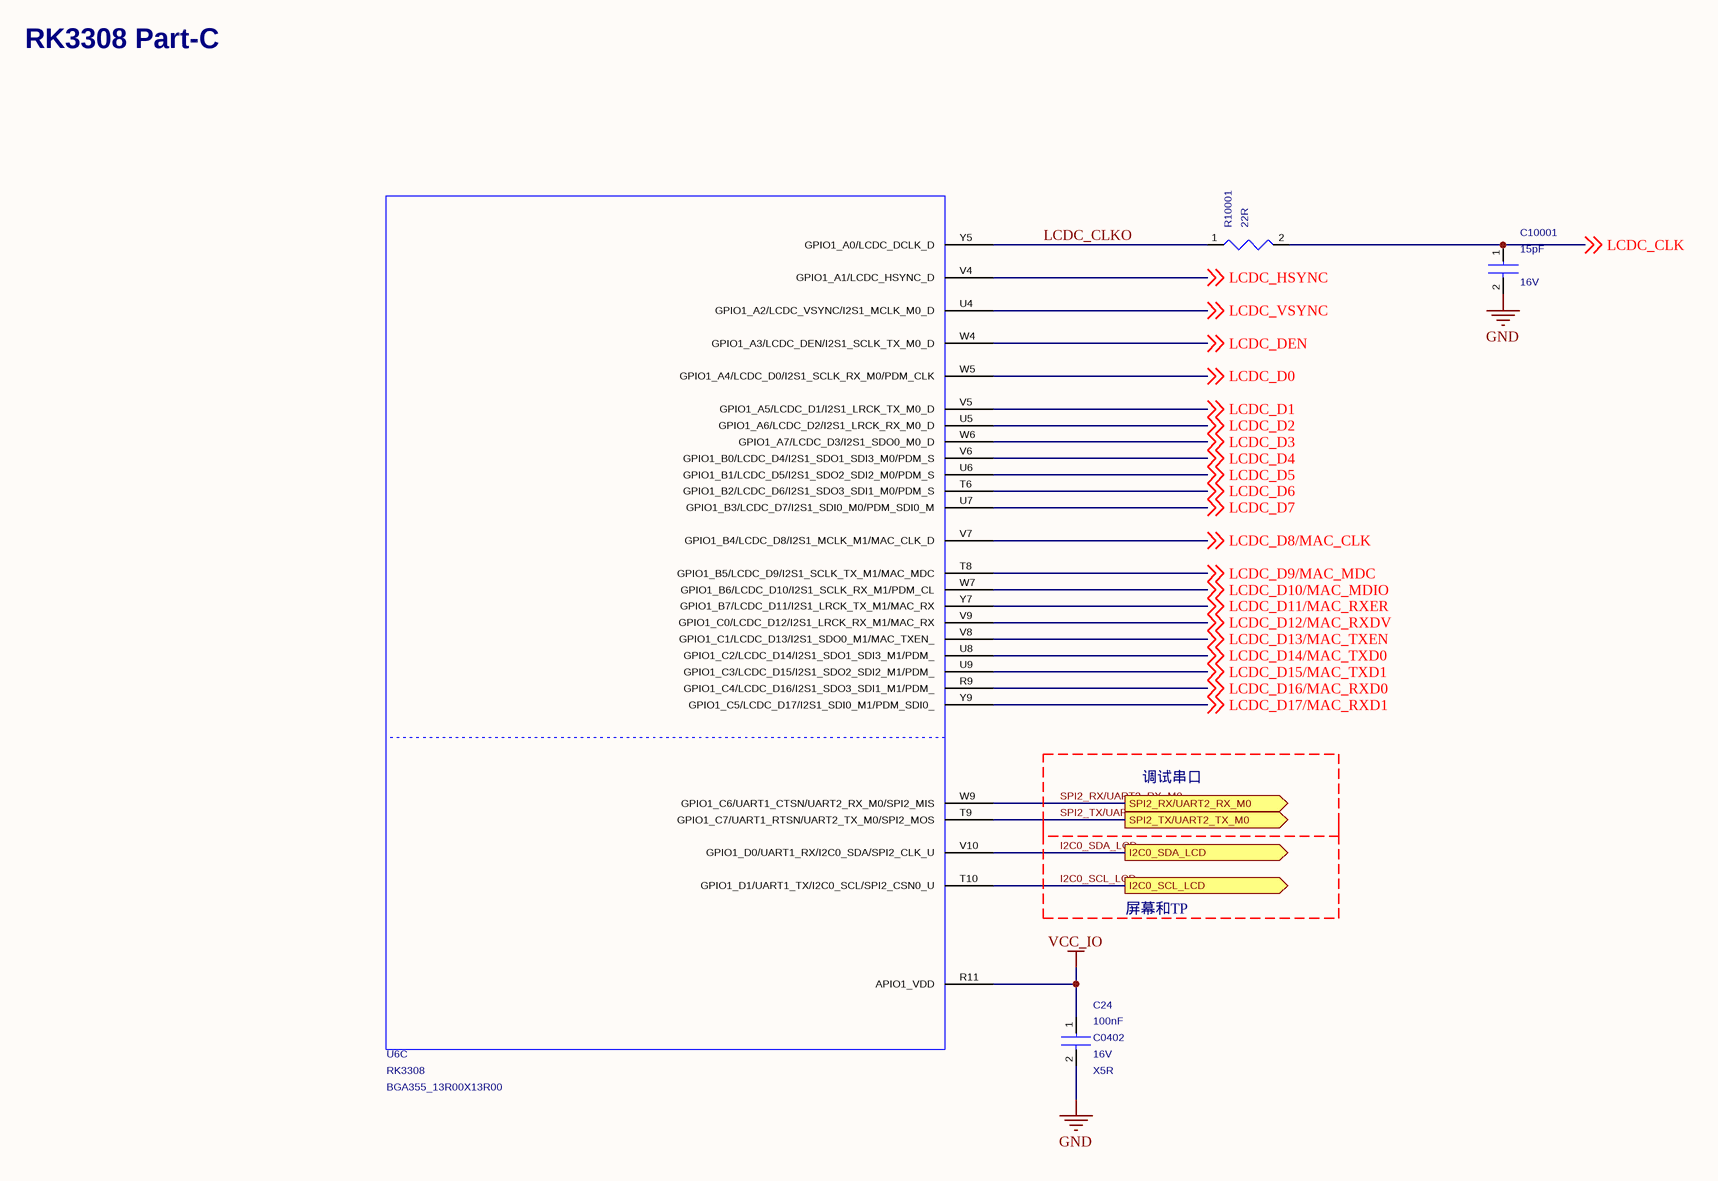
[diagram p18: 10_LCDC_MAC_I2S1_JTAG.SchDoc]

### Parts
C24  value 100nF  Dielectric: X5R  Voltage: 16V  [C0402]  (hidden comment: CAP_NP_2)
C10001  value 15pF  Voltage: 16V  [C0402]  (hidden comment: CAP_NP_2)
R10001  value 22R  [R0402]  (hidden comment: RESISTOR)
U6  RK3308  [BGA355_13R00X13R00]  (part C of 14)

### Ports
I2C0_SCL_LCD (out), I2C0_SDA_LCD (out), SPI2_RX/UART2_RX_M0 (out), SPI2_TX/UART2_TX_M0 (out)

### Nets
GND: C24.2 C10001.2
VCC_IO: C24.1 U6.R11(APIO1_VDD)
I2C0_SCL_LCD: U6.T10(GPIO1_D1/UART1_TX/I2C0_SCL/SPI2_CSN0_U) ; port I2C0_SCL_LCD
I2C0_SDA_LCD: U6.V10(GPIO1_D0/UART1_RX/I2C0_SDA/SPI2_CLK_U) ; port I2C0_SDA_LCD
LCDC_CLK: C10001.1 R10001.2 ; off-sheet LCDC_CLK
LCDC_CLKO: R10001.1 U6.Y5(GPIO1_A0/LCDC_DCLK_D)
LCDC_D0: U6.W5(GPIO1_A4/LCDC_D0/I2S1_SCLK_RX_M0/PDM_CLK) ; off-sheet LCDC_D0
LCDC_D1: U6.V5(GPIO1_A5/LCDC_D1/I2S1_LRCK_TX_M0_D) ; off-sheet LCDC_D1
LCDC_D2: U6.U5(GPIO1_A6/LCDC_D2/I2S1_LRCK_RX_M0_D) ; off-sheet LCDC_D2
LCDC_D3: U6.W6(GPIO1_A7/LCDC_D3/I2S1_SDO0_M0_D) ; off-sheet LCDC_D3
LCDC_D4: U6.V6(GPIO1_B0/LCDC_D4/I2S1_SDO1_SDI3_M0/PDM_S) ; off-sheet LCDC_D4
LCDC_D5: U6.U6(GPIO1_B1/LCDC_D5/I2S1_SDO2_SDI2_M0/PDM_S) ; off-sheet LCDC_D5
LCDC_D6: U6.T6(GPIO1_B2/LCDC_D6/I2S1_SDO3_SDI1_M0/PDM_S) ; off-sheet LCDC_D6
LCDC_D7: U6.U7(GPIO1_B3/LCDC_D7/I2S1_SDI0_M0/PDM_SDI0_M) ; off-sheet LCDC_D7
LCDC_D8/MAC_CLK: U6.V7(GPIO1_B4/LCDC_D8/I2S1_MCLK_M1/MAC_CLK_D) ; off-sheet LCDC_D8/MAC_CLK
LCDC_D9/MAC_MDC: U6.T8(GPIO1_B5/LCDC_D9/I2S1_SCLK_TX_M1/MAC_MDC) ; off-sheet LCDC_D9/MAC_MDC
LCDC_D10/MAC_MDIO: U6.W7(GPIO1_B6/LCDC_D10/I2S1_SCLK_RX_M1/PDM_CL) ; off-sheet LCDC_D10/MAC_MDIO
LCDC_D11/MAC_RXER: U6.Y7(GPIO1_B7/LCDC_D11/I2S1_LRCK_TX_M1/MAC_RX) ; off-sheet LCDC_D11/MAC_RXER
LCDC_D12/MAC_RXDV: U6.V9(GPIO1_C0/LCDC_D12/I2S1_LRCK_RX_M1/MAC_RX) ; off-sheet LCDC_D12/MAC_RXDV
LCDC_D13/MAC_TXEN: U6.V8(GPIO1_C1/LCDC_D13/I2S1_SDO0_M1/MAC_TXEN_) ; off-sheet LCDC_D13/MAC_TXEN
LCDC_D14/MAC_TXD0: U6.U8(GPIO1_C2/LCDC_D14/I2S1_SDO1_SDI3_M1/PDM_) ; off-sheet LCDC_D14/MAC_TXD0
LCDC_D15/MAC_TXD1: U6.U9(GPIO1_C3/LCDC_D15/I2S1_SDO2_SDI2_M1/PDM_) ; off-sheet LCDC_D15/MAC_TXD1
LCDC_D16/MAC_RXD0: U6.R9(GPIO1_C4/LCDC_D16/I2S1_SDO3_SDI1_M1/PDM_) ; off-sheet LCDC_D16/MAC_RXD0
LCDC_D17/MAC_RXD1: U6.Y9(GPIO1_C5/LCDC_D17/I2S1_SDI0_M1/PDM_SDI0_) ; off-sheet LCDC_D17/MAC_RXD1
LCDC_DEN: U6.W4(GPIO1_A3/LCDC_DEN/I2S1_SCLK_TX_M0_D) ; off-sheet LCDC_DEN
LCDC_HSYNC: U6.V4(GPIO1_A1/LCDC_HSYNC_D) ; off-sheet LCDC_HSYNC
LCDC_VSYNC: U6.U4(GPIO1_A2/LCDC_VSYNC/I2S1_MCLK_M0_D) ; off-sheet LCDC_VSYNC
SPI2_RX/UART2_RX_M0: U6.W9(GPIO1_C6/UART1_CTSN/UART2_RX_M0/SPI2_MIS) ; port SPI2_RX/UART2_RX_M0
SPI2_TX/UART2_TX_M0: U6.T9(GPIO1_C7/UART1_RTSN/UART2_TX_M0/SPI2_MOS) ; port SPI2_TX/UART2_TX_M0

### Notes on the sheet
- RK3308 Part-C
- 调试串口
- 屏幕和TP
- Title
- Size:
- Date:
- A3
- Engineer:
- Time:
- Revision:
- Sheet
- of
- File:

### Library data of the parts
C24 = CAP_NP_2: cap,100.00nF,+/-10%,16V,X5R,C0402; Manufacturer: TDK; RK_PN: C1005X5R1C104K050BA; Priority: A; Tolerance: 10%; Created_by: JJJ; Source_Path: Z:\RK_STANDARD_LIBRARY\CADENCE_CIS\RK_DISCRETE.OLB; Number: 1; C_Voltage: 6.3V; PCB DECAL: C0402; Part_Type: C0402; Manufacturer_PN: C1005X5R1C104K050BA
C10001 = CAP_NP_2: cap,15pF,+/-10%,16V,X5R,C0402; Manufacturer: TDK; RK_PN: C1005X5R1C104K050BA; Priority: A; Tolerance: 10%; Created_by: JJJ; Source_Path: Z:\RK_STANDARD_LIBRARY\CADENCE_CIS\RK_DISCRETE.OLB; Number: 1; C_Voltage: 6.3V; PCB DECAL: C0402; Part_Type: C0402; Dielectric: X5R; Manufacturer_PN: C1005X5R1C104K050BA
R10001 = RESISTOR: ?用厚膜电阻,22R,+/-1%,R0402,1/16W.; Manufacturer_PN: RC0402FR-0751KL; Manufacturer: YAGEO; Created_by: YTL; Wattage: 1/16W; Tolerance: 1%; Priority: A; Source_Path: Z:\RK_STANDARD_LIBRARY\CADENCE_CIS\RK_DISCRETE.OLB; Option: DNP; Part_Type: ?用厚膜电阻; RK_PN: RC0402FR-0751KL; PCB DECAL: R0402
U6 = RK3308: as U6 on sheet 04_POWER; Manufacturer_PN: RK3308; PCB DECAL: BGA355_13R00X13R00; Value: RK3308